# EAGLE board iob9xvrs (EAGLE 6.6.0), part 1 of 2
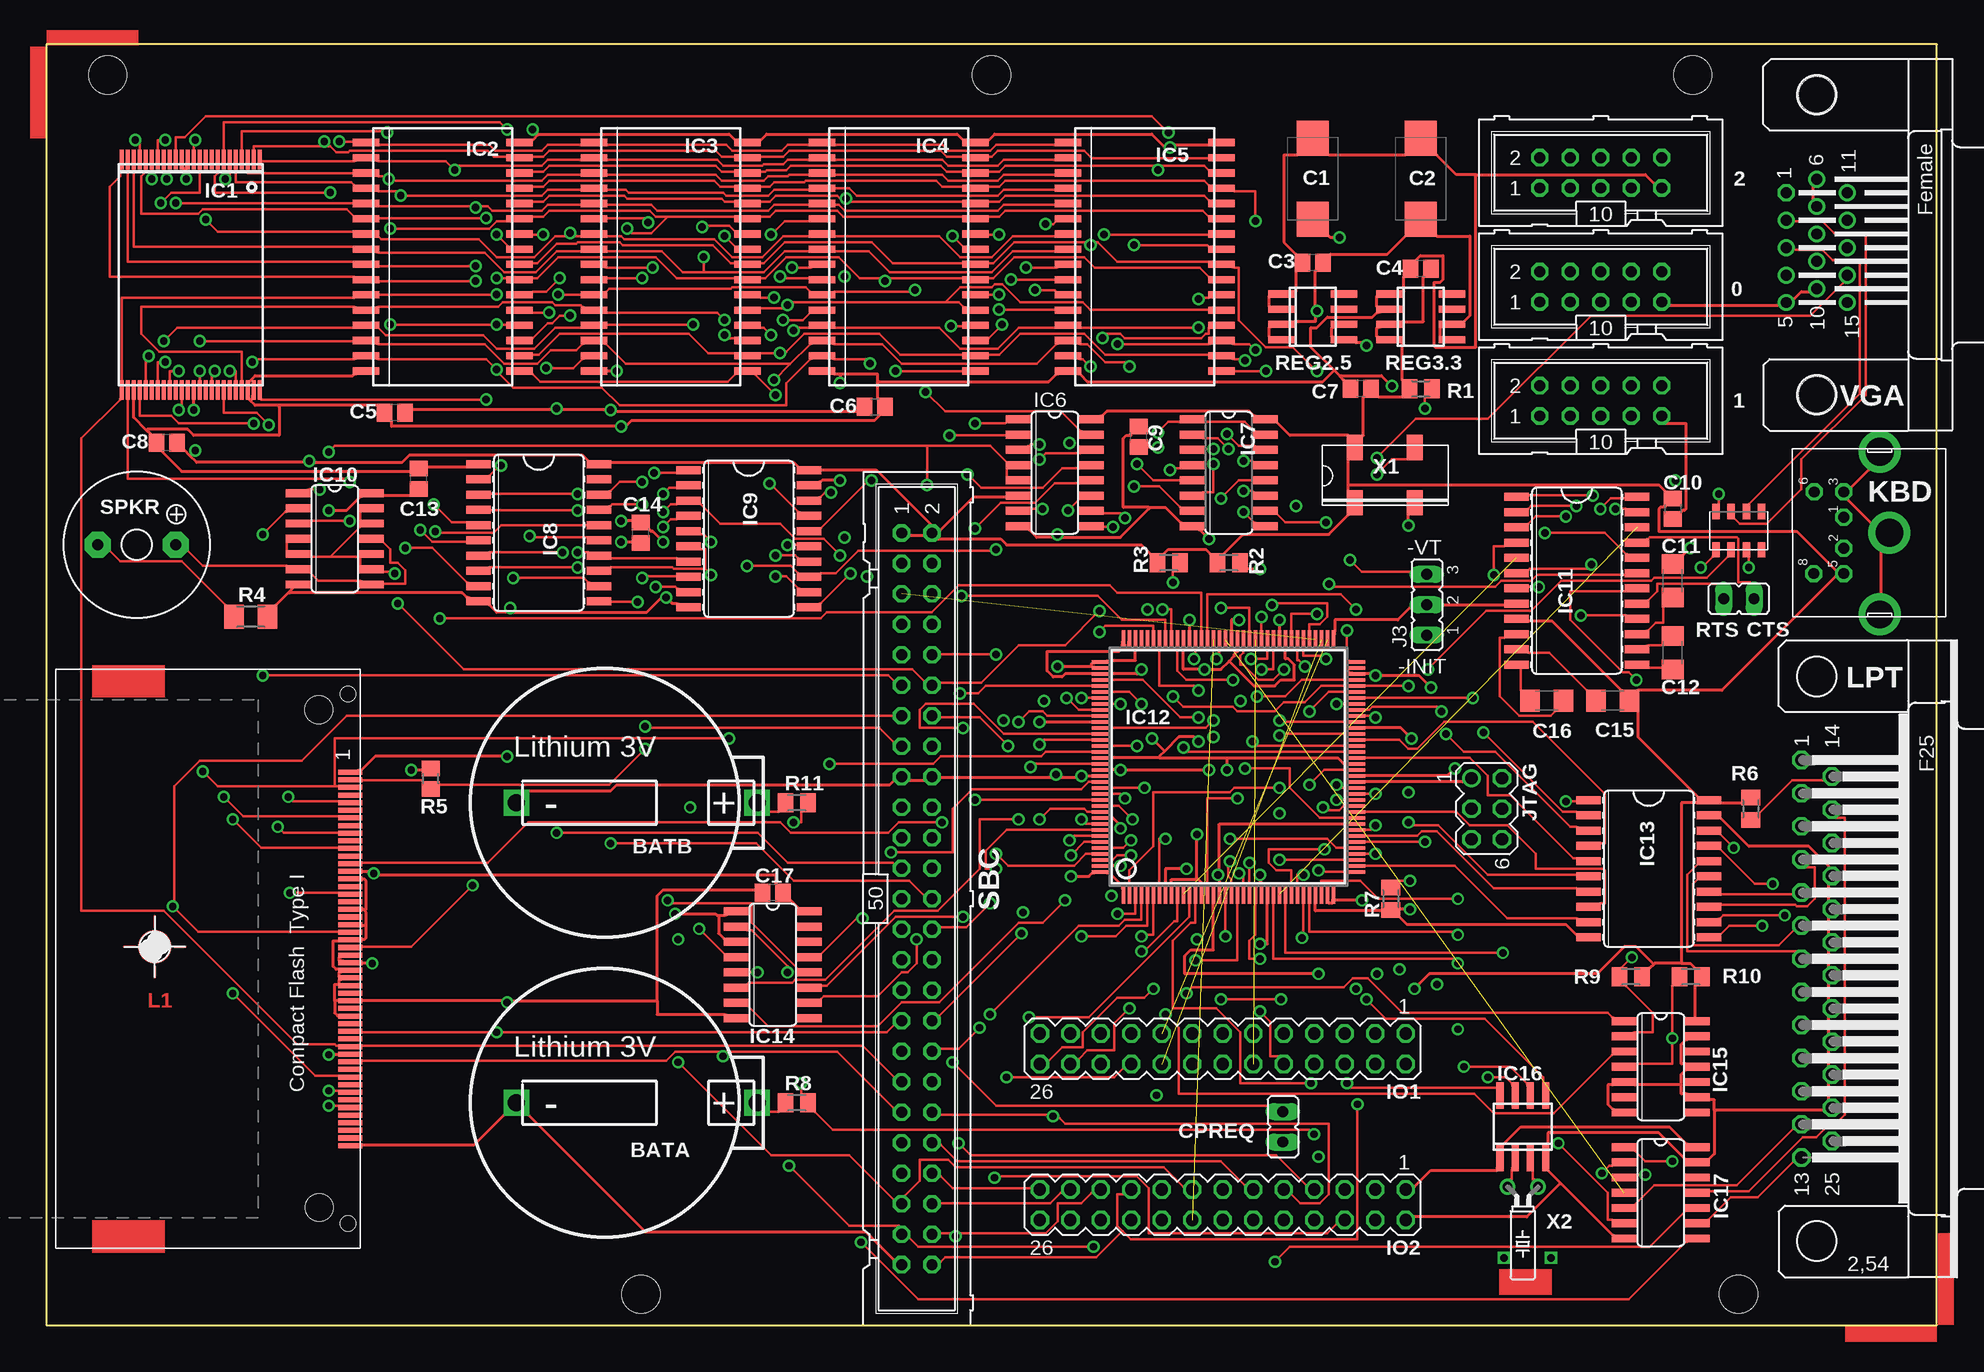
[diagram p7: board, top side]
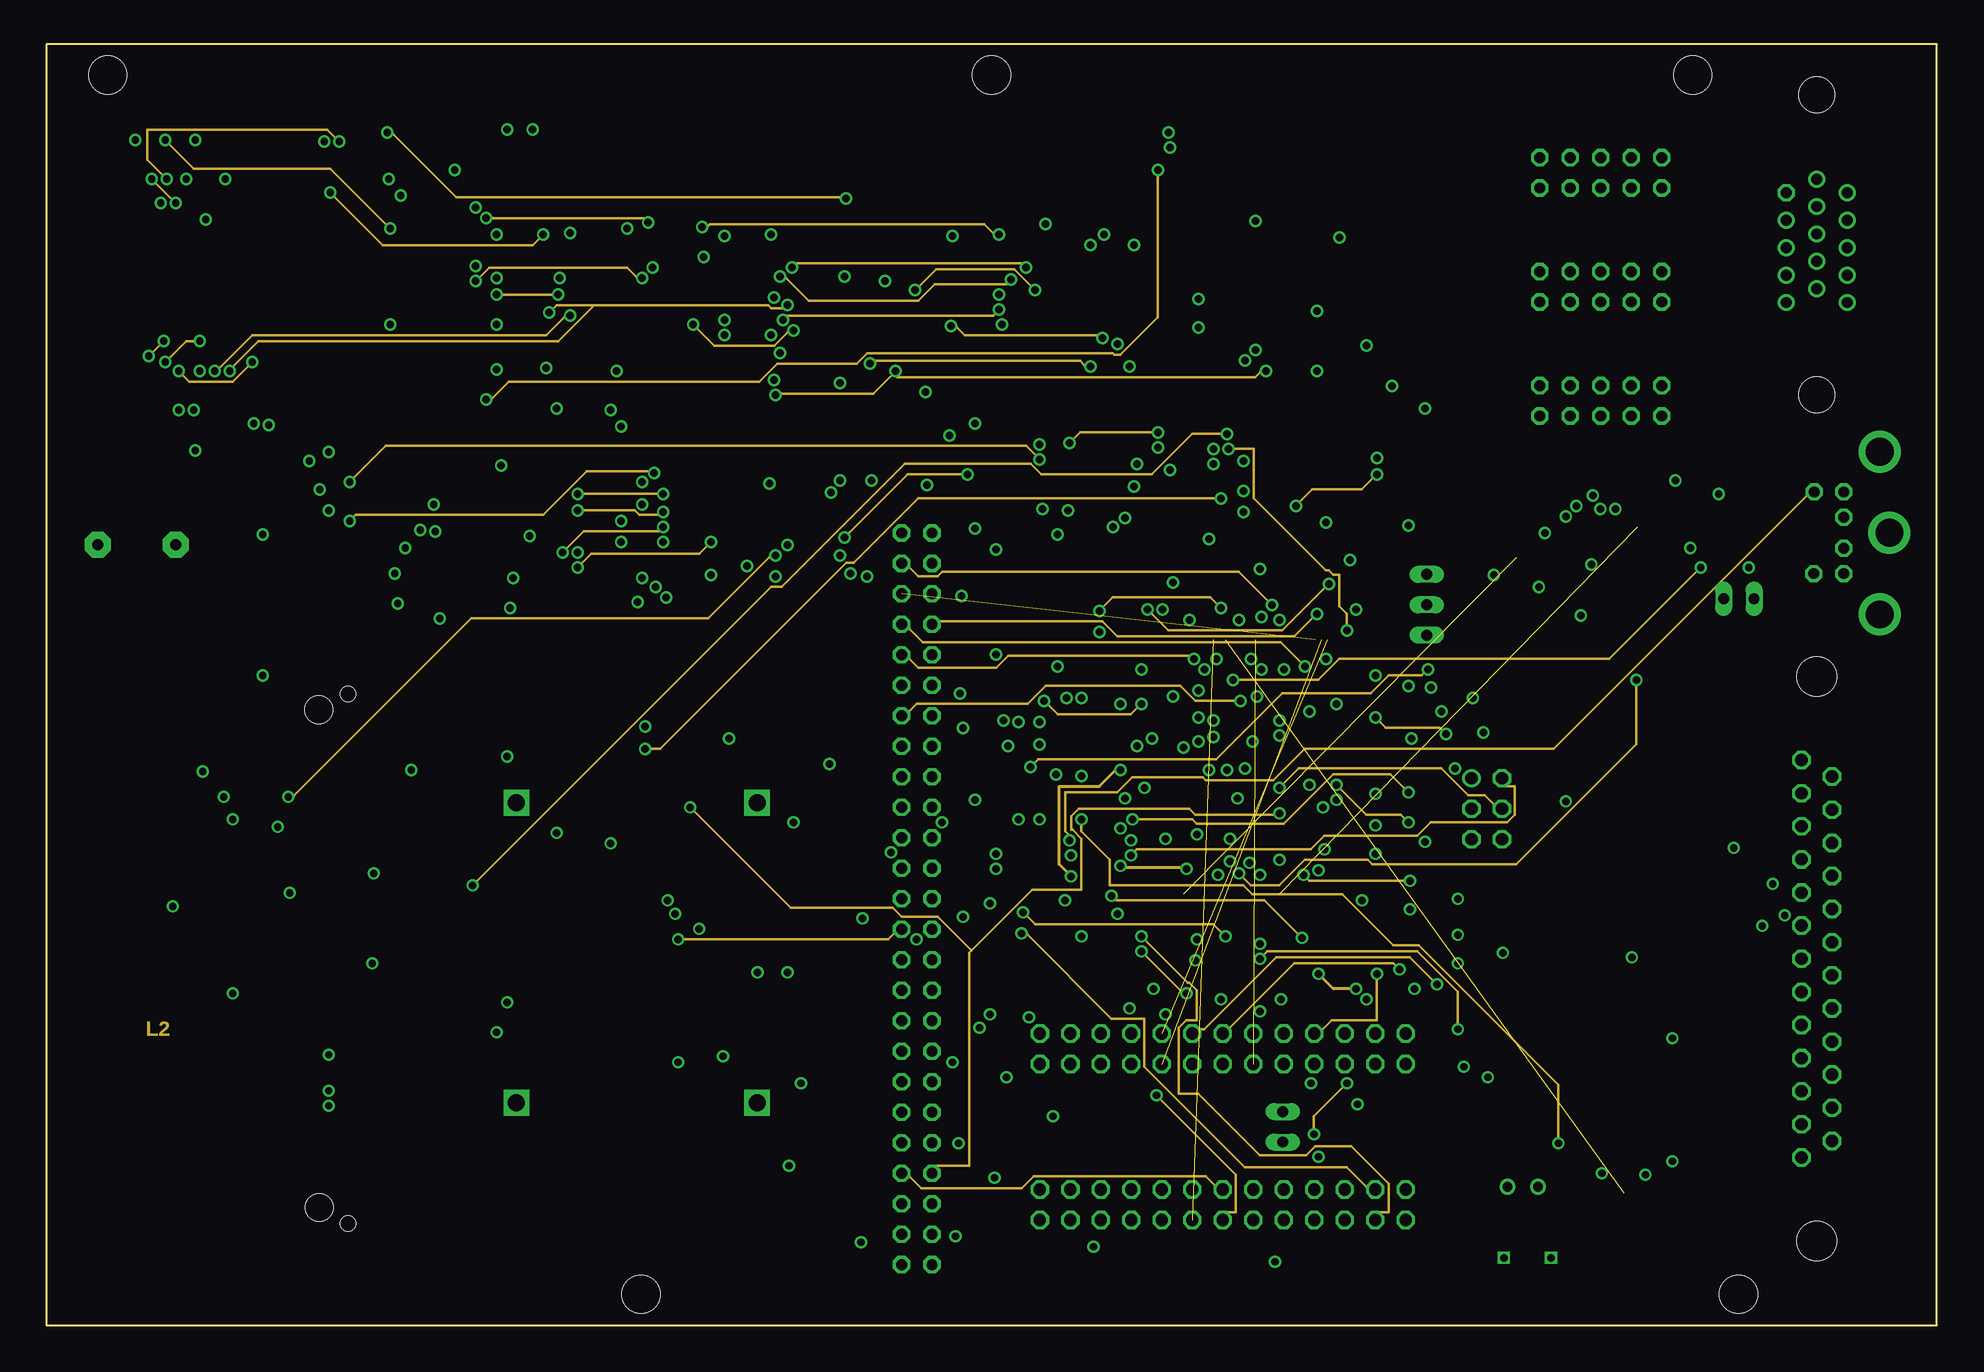
[diagram p8: board, inner layer Route2]
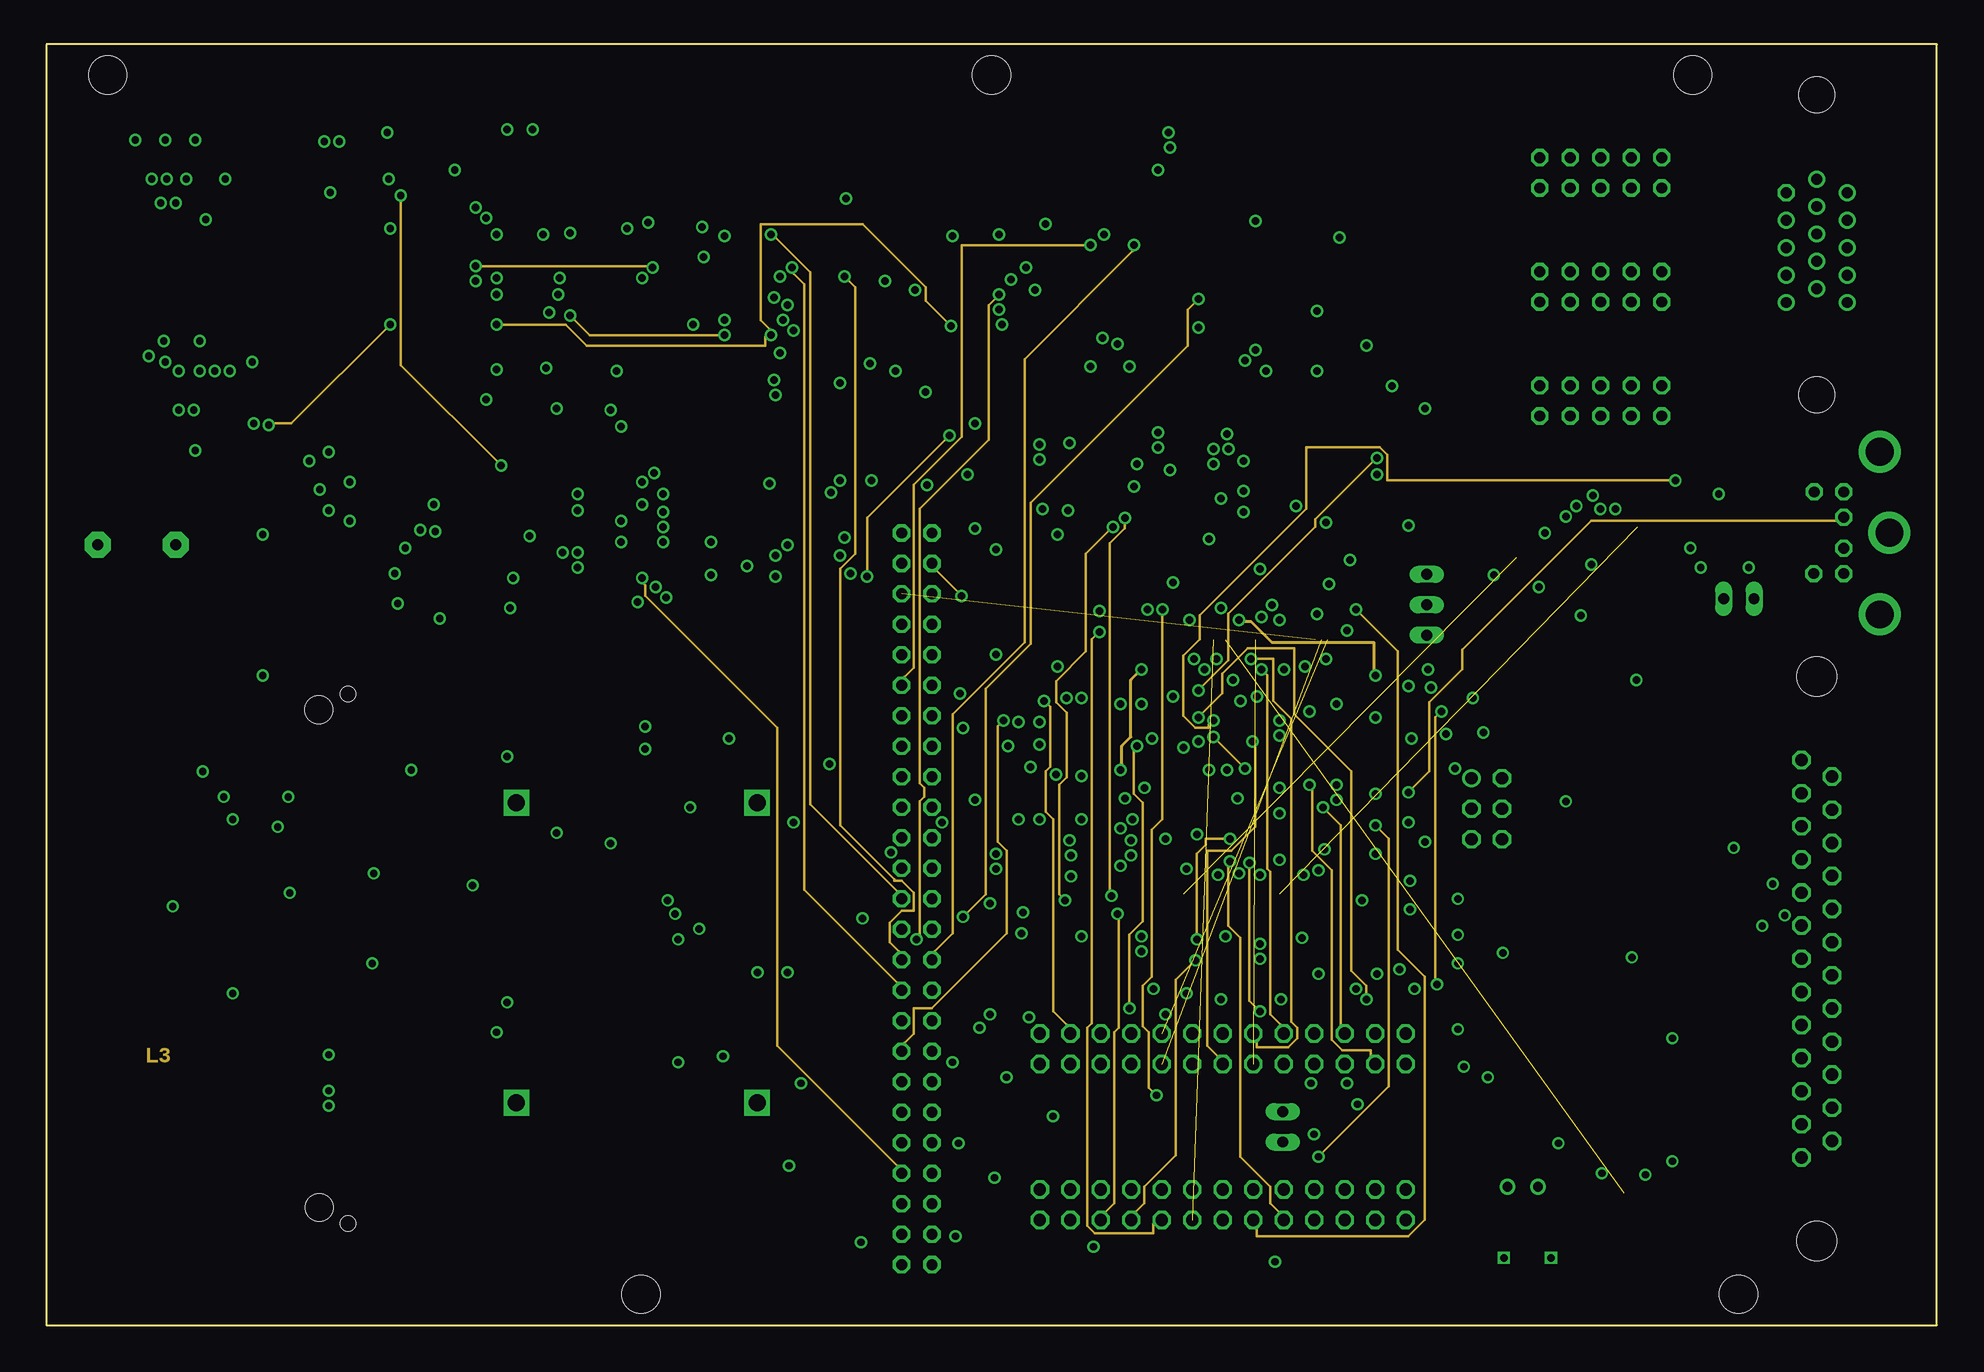
[diagram p9: board, inner layer Route15]
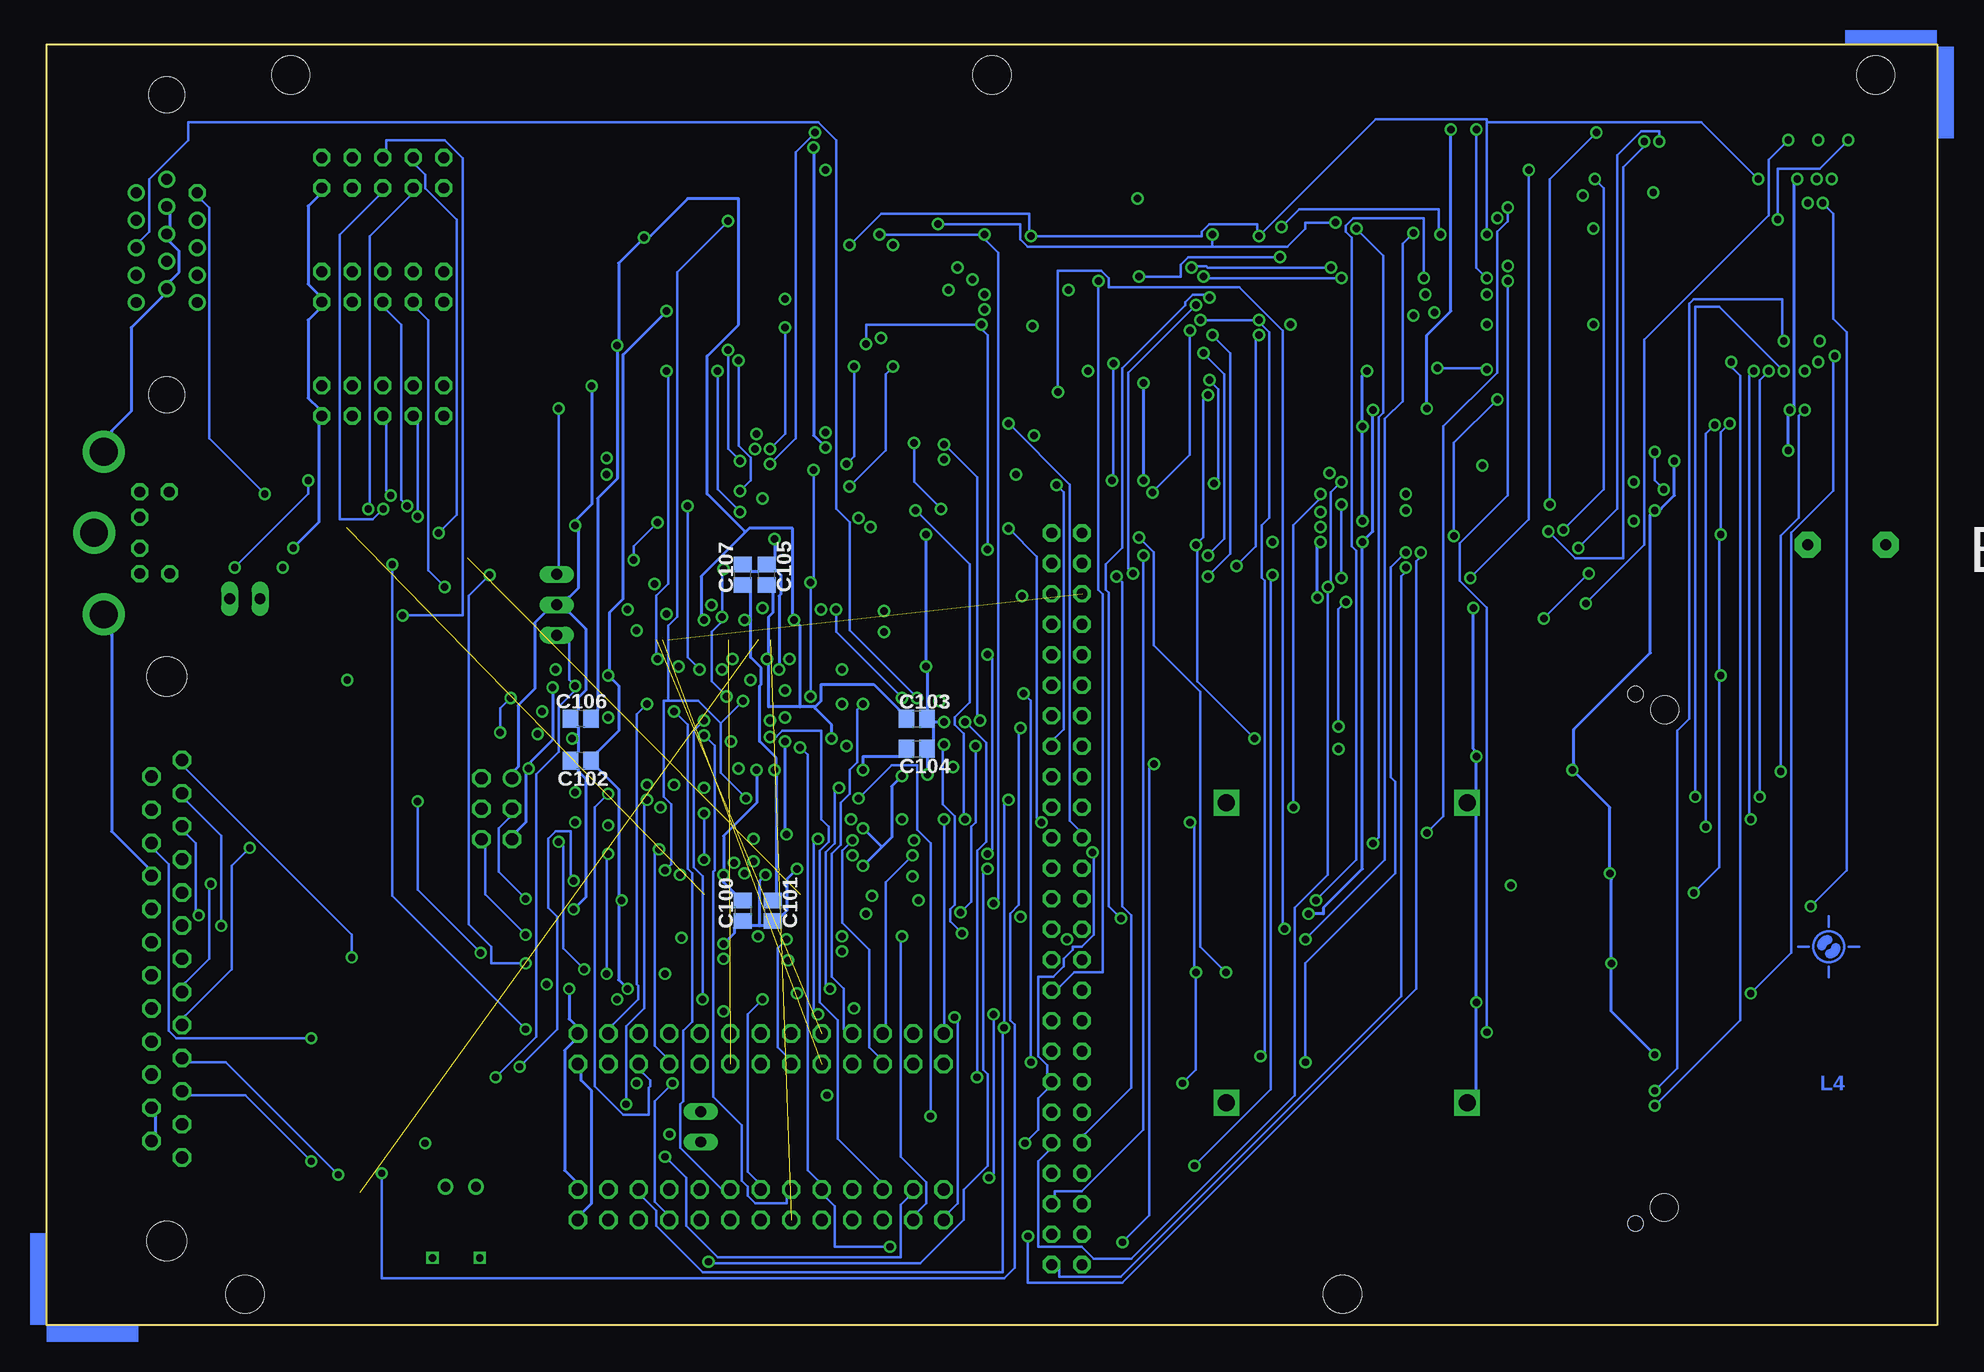
[diagram p10: board, bottom side, seen from below]

Size 157.53 x 106.73 mm. Coordinates in mm from the lower left corner, seen from the top.
Outline: 0,0 157.53,0 157.53,106.73 0,106.73 0,0
Copper layers (1*2*15*16): Top 0.035mm / dielectric 1.5mm / Route2 0.035mm / dielectric 0.15mm / Route15 0.035mm / dielectric 0.2mm / Bottom 0.035mm
Design rules "8mils": minimum track width 8mil, minimum drill 24mil, track to track 7mil, track to pad 7mil, pad to pad 7mil, via to via 7mil, smd to smd 7mil, copper to edge 25mil, drill to drill 8mil, minimum pad ring 10mil, minimum via ring 8mil, stop-mask expansion 0mil, vias tented up to drill 0mil, thermal gap 10mil
Net classes: 1 power: width 0.254 mm, drill 0.381 mm; 2 gnd: width 0.254 mm, drill 0.381 mm
Holes 3.17 mm at 78.77,104.17 141,2.57 5.11,104.17 49.56,2.57 137.19,104.17

## Footprints (pad centres in the part's own frame; a part is rotated, then mirrored left to right if it is on the bottom)
CR2032HOLDER = drill 1.422 square: + 12.7,0; - -7.366,0
D/7343-31W = smd 2.95 x 2.7: + 3.375,0; - -3.375,0
C0805 = smd 1.3 x 1.5: 1 -0.85,0; 2 0.85,0
C1206 = smd 1.6 x 1.8: 1 -1.4,0; 2 1.4,0
CF_SOCKET2_SMT = smd 0.42 x 2: 1 15.545,-17.805; 2 14.275,-17.805; 3 13.005,-17.805; 4 11.735,-17.805; 5 10.465,-17.805; 6 9.195,-17.805; 7 7.925,-17.805; 8 6.655,-17.805; 9 5.385,-17.805; 10 4.115,-17.805; 11 2.845,-17.805; 12 1.575,-17.805; 13 0.305,-17.805; 14 -0.965,-17.805; 15 -2.235,-17.805; 16 -3.505,-17.805; 17 -4.775,-17.805; 18 -6.045,-17.805; 19 -7.315,-17.805; 20 -8.585,-17.805; 21 -9.855,-17.805; 22 -11.125,-17.805; 23 -12.395,-17.805; 24 -13.665,-17.805; 25 -14.935,-17.805; 26 14.91,-17.805; 27 13.64,-17.805; 28 12.37,-17.805; 29 11.1,-17.805; 30 9.83,-17.805; 31 8.56,-17.805; 32 7.29,-17.805; 33 6.02,-17.805; 34 4.75,-17.805; 35 3.48,-17.805; 36 2.21,-17.805; 37 0.94,-17.805; 38 -0.33,-17.805; 39 -1.6,-17.805; 40 -2.87,-17.805; 41 -4.14,-17.805; 42 -5.41,-17.805; 43 -6.68,-17.805; 44 -7.95,-17.805; 45 -9.22,-17.805; 46 -10.49,-17.805; 47 -11.76,-17.805; 48 -13.03,-17.805; 49 -14.3,-17.805; 50 -15.57,-17.805 | hole 2.3: 20.747,-15.177; -20.72,-15.208 | hole 1.27: -22.062,-17.6; 22.048,-17.6
JP1 = drill 0.914 long: 1 0,-1.27; 2 0,1.27
TSOP48 = smd 0.3 x 1.6: 1 -6.25,-9.1; 2 -5.75,-9.1; 3 -5.25,-9.1; 4 -4.75,-9.1; 5 -4.25,-9.1; 6 -3.75,-9.1; 7 -3.25,-9.1; 8 -2.75,-9.1; 9 -2.25,-9.1; 10 -1.75,-9.1; 11 -1.25,-9.1; 12 -0.75,-9.1; 13 -0.25,-9.1; 14 0.25,-9.1; 15 0.75,-9.1; 16 1.25,-9.1; 17 1.75,-9.1; 18 2.25,-9.1; 19 2.75,-9.1; 20 3.25,-9.1; 21 3.75,-9.1; 22 4.25,-9.1; 23 4.75,-9.1; 24 5.25,-9.1; 25 5.25,10.1; 26 4.75,10.1; 27 4.25,10.1; 28 3.75,10.1; 29 3.25,10.1; 30 2.75,10.1; 31 2.25,10.1; 32 1.75,10.1; 33 1.25,10.1; 34 0.75,10.1; 35 0.25,10.1; 36 -0.25,10.1; 37 -0.75,10.1; 38 -1.25,10.1; 39 -1.75,10.1; 40 -2.25,10.1; 41 -2.75,10.1; 42 -3.25,10.1; 43 -3.75,10.1; 44 -4.25,10.1; 45 -4.75,10.1; 46 -5.25,10.1; 47 -5.75,10.1; 48 -6.25,10.1
SOP32 = smd 0.6 x 2.2: 1 -9.525,-6.4; 2 -8.255,-6.4; 3 -6.985,-6.4; 4 -5.715,-6.4; 5 -4.445,-6.4; 6 -3.175,-6.4; 7 -1.905,-6.4; 8 -0.635,-6.4; 9 0.635,-6.4; 10 1.905,-6.4; 11 3.175,-6.4; 12 4.445,-6.4; 13 5.715,-6.4; 14 6.985,-6.4; 15 8.255,-6.4; 16 9.525,-6.4; 17 9.525,6.4; 18 8.255,6.4; 19 6.985,6.4; 20 5.715,6.4; 21 4.445,6.4; 22 3.175,6.4; 23 1.905,6.4; 24 0.635,6.4; 25 -0.635,6.4; 26 -1.905,6.4; 27 -3.175,6.4; 28 -4.445,6.4; 29 -5.715,6.4; 30 -6.985,6.4; 31 -8.255,6.4; 32 -9.525,6.4
SO16 = smd 0.66 x 2.032: 1 -4.445,-3.073; 2 -3.175,-3.073; 3 -1.905,-3.073; 4 -0.635,-3.073; 5 0.635,-3.073; 6 1.905,-3.073; 7 3.175,-3.073; 8 4.445,-3.073; 9 4.445,3.073; 10 3.175,3.073; 11 1.905,3.073; 12 0.635,3.073; 13 -0.635,3.073; 14 -1.905,3.073; 15 -3.175,3.073; 16 -4.445,3.073
SO20W = smd 0.66 x 2.032: 1 -5.715,-5.029; 2 -4.445,-5.029; 3 -3.175,-5.029; 4 -1.905,-5.029; 5 -0.635,-5.029; 6 0.635,-5.029; 7 1.905,-5.029; 8 3.175,-5.029; 9 4.445,-5.029; 10 5.715,-5.029; 11 5.715,5.029; 12 4.445,5.029; 13 3.175,5.029; 14 1.905,5.029; 15 0.635,5.029; 16 -0.635,5.029; 17 -1.905,5.029; 18 -3.175,5.029; 19 -4.445,5.029; 20 -5.715,5.029
SO14 = smd 0.66 x 2.032: 1 -3.81,-3.073; 2 -2.54,-3.073; 3 -1.27,-3.073; 4 0,-3.073; 5 1.27,-3.073; 6 2.54,-3.073; 7 3.81,-3.073; 8 3.81,3.073; 9 2.54,3.073; 10 1.27,3.073; 11 0,3.073; 12 -1.27,3.073; 13 -2.54,3.073; 14 -3.81,3.073
SO24L = smd 0.66 x 2.032: 1 -6.985,-5.029; 2 -5.715,-5.029; 3 -4.445,-5.029; 4 -3.175,-5.029; 5 -1.905,-5.029; 6 -0.635,-5.029; 7 0.635,-5.029; 8 1.905,-5.029; 9 3.175,-5.029; 10 4.445,-5.029; 11 5.715,-5.029; 12 6.985,-5.029; 13 6.985,5.029; 14 5.715,5.029; 15 4.445,5.029; 16 3.175,5.029; 17 1.905,5.029; 18 0.635,5.029; 19 -0.635,5.029; 20 -1.905,5.029; 21 -3.175,5.029; 22 -4.445,5.029; 23 -5.715,5.029; 24 -6.985,5.029
TQFP144 = smd 0.3 x 1.6: 1 -8.75,-10.6; 2 -8.25,-10.6; 3 -7.75,-10.6; 4 -7.25,-10.6; 5 -6.75,-10.6; 6 -6.25,-10.6; 7 -5.75,-10.6; 8 -5.25,-10.6; 9 -4.75,-10.6; 10 -4.25,-10.6; 11 -3.75,-10.6; 12 -3.25,-10.6; 13 -2.75,-10.6; 14 -2.25,-10.6; 15 -1.75,-10.6; 16 -1.25,-10.6; 17 -0.75,-10.6; 18 -0.25,-10.6; 19 0.25,-10.6; 20 0.75,-10.6; 21 1.25,-10.6; 22 1.75,-10.6; 23 2.25,-10.6; 24 2.75,-10.6; 25 3.25,-10.6; 26 3.75,-10.6; 27 4.25,-10.6; 28 4.75,-10.6; 29 5.25,-10.6; 30 5.75,-10.6; 31 6.25,-10.6; 32 6.75,-10.6; 33 7.25,-10.6; 34 7.75,-10.6; 35 8.25,-10.6; 36 8.75,-10.6; 73 8.75,10.6; 74 8.25,10.6; 75 7.75,10.6; 76 7.25,10.6; 77 6.75,10.6; 78 6.25,10.6; 79 5.75,10.6; 80 5.25,10.6; 81 4.75,10.6; 82 4.25,10.6; 83 3.75,10.6; 84 3.25,10.6; 85 2.75,10.6; 86 2.25,10.6; 87 1.75,10.6; 88 1.25,10.6; 89 0.75,10.6; 90 0.25,10.6; 91 -0.25,10.6; 92 -0.75,10.6; 93 -1.25,10.6; 94 -1.75,10.6; 95 -2.25,10.6; 96 -2.75,10.6; 97 -3.25,10.6; 98 -3.75,10.6; 99 -4.25,10.6; 100 -4.75,10.6; 101 -5.25,10.6; 102 -5.75,10.6; 103 -6.25,10.6; 104 -6.75,10.6; 105 -7.25,10.6; 106 -7.75,10.6; 107 -8.25,10.6; 108 -8.75,10.6 | smd 1.6 x 0.3: 37 10.6,-8.75; 38 10.6,-8.25; 39 10.6,-7.75; 40 10.6,-7.25; 41 10.6,-6.75; 42 10.6,-6.25; 43 10.6,-5.75; 44 10.6,-5.25; 45 10.6,-4.75; 46 10.6,-4.25; 47 10.6,-3.75; 48 10.6,-3.25; 49 10.6,-2.75; 50 10.6,-2.25; 51 10.6,-1.75; 52 10.6,-1.25; 53 10.6,-0.75; 54 10.6,-0.25; 55 10.6,0.25; 56 10.6,0.75; 57 10.6,1.25; 58 10.6,1.75; 59 10.6,2.25; 60 10.6,2.75; 61 10.6,3.25; 62 10.6,3.75; 63 10.6,4.25; 64 10.6,4.75; 65 10.6,5.25; 66 10.6,5.75; 67 10.6,6.25; 68 10.6,6.75; 69 10.6,7.25; 70 10.6,7.75; 71 10.6,8.25; 72 10.6,8.75; 109 -10.6,8.75; 110 -10.6,8.25; 111 -10.6,7.75; 112 -10.6,7.25; 113 -10.6,6.75; 114 -10.6,6.25; 115 -10.6,5.75; 116 -10.6,5.25; 117 -10.6,4.75; 118 -10.6,4.25; 119 -10.6,3.75; 120 -10.6,3.25; 121 -10.6,2.75; 122 -10.6,2.25; 123 -10.6,1.75; 124 -10.6,1.25; 125 -10.6,0.75; 126 -10.6,0.25; 127 -10.6,-0.25; 128 -10.6,-0.75; 129 -10.6,-1.25; 130 -10.6,-1.75; 131 -10.6,-2.25; 132 -10.6,-2.75; 133 -10.6,-3.25; 134 -10.6,-3.75; 135 -10.6,-4.25; 136 -10.6,-4.75; 137 -10.6,-5.25; 138 -10.6,-5.75; 139 -10.6,-6.25; 140 -10.6,-6.75; 141 -10.6,-7.25; 142 -10.6,-7.75; 143 -10.6,-8.25; 144 -10.6,-8.75
SO08 = smd 0.6 x 2.2: 1 -1.905,-2.6; 2 -0.635,-2.6; 3 0.635,-2.6; 4 1.905,-2.6; 5 1.905,2.6; 6 0.635,2.6; 7 -0.635,2.6; 8 -1.905,2.6
MA13-2 = drill 1.016 octagon: 1 -15.24,-1.27; 2 -15.24,1.27; 3 -12.7,-1.27; 4 -12.7,1.27; 5 -10.16,-1.27; 6 -10.16,1.27; 7 -7.62,-1.27; 8 -7.62,1.27; 9 -5.08,-1.27; 10 -5.08,1.27; 11 -2.54,-1.27; 12 -2.54,1.27; 13 0,-1.27; 14 0,1.27; 15 2.54,-1.27; 16 2.54,1.27; 17 5.08,-1.27; 18 5.08,1.27; 19 7.62,-1.27; 20 7.62,1.27; 21 10.16,-1.27; 22 10.16,1.27; 23 12.7,-1.27; 24 12.7,1.27; 25 15.24,-1.27; 26 15.24,1.27
JP2 = drill 0.914 long: 1 -2.54,0; 2 0,0; 3 2.54,0
MA03-2 = drill 1.016: 1 -2.54,-1.27 | drill 1.016 octagon: 2 -2.54,1.27; 3 0,-1.27; 4 0,1.27; 5 2.54,-1.27; 6 2.54,1.27
M_DIN6 = drill 0.9 pad 1.422 octagon: 1 -1.3,-3.75; 2 1.3,-3.75; 3 -3.4,-3.75; 5 3.4,-3.75; 6 -3.4,-6.2; 8 3.4,-6.25 | drill 2.3 pad 3.5: SH1 6.8,-0.75; SH2 0,0.05; SH3 -6.75,-0.75
F25H = drill 1.016 octagon: 1 -16.561,-1.27; 2 -13.792,-1.27; 3 -11.049,-1.27; 4 -8.28,-1.27; 5 -5.512,-1.27; 6 -2.769,-1.27; 7 0,-1.27; 8 2.769,-1.27; 9 5.512,-1.27; 10 8.28,-1.27; 11 11.049,-1.27; 12 13.792,-1.27; 13 16.561,-1.27; 14 -15.189,1.27; 15 -12.421,1.27; 16 -9.652,1.27; 17 -6.909,1.27; 18 -4.14,1.27; 19 -1.372,1.27; 20 1.372,1.27; 21 4.14,1.27; 22 6.909,1.27; 23 9.652,1.27; 24 12.421,1.27; 25 15.189,1.27 | hole 3.302: -23.52,0; 23.52,0
M0805 = smd 1.3 x 1.6: 1 -0.95,0; 2 0.95,0
M1206 = smd 1.6 x 2: 1 -1.4,0; 2 1.4,0
R0805 = smd 1.3 x 1.5: 1 -0.85,0; 2 0.85,0
RN-CTS-744C043 = smd 0.635 x 1.27: 1 -1.905,-1.905; 2 -0.635,-1.905; 3 0.635,-1.905; 4 1.905,-1.905; 5 1.905,1.27; 6 0.635,1.27; 7 -0.635,1.27; 8 -1.905,1.27
ML50 = drill 0.914 octagon: 1 -30.48,-1.27; 2 -30.48,1.27; 3 -27.94,-1.27; 4 -27.94,1.27; 5 -25.4,-1.27; 6 -25.4,1.27; 7 -22.86,-1.27; 8 -22.86,1.27; 9 -20.32,-1.27; 10 -20.32,1.27; 11 -17.78,-1.27; 12 -17.78,1.27; 13 -15.24,-1.27; 14 -15.24,1.27; 15 -12.7,-1.27; 16 -12.7,1.27; 17 -10.16,-1.27; 18 -10.16,1.27; 19 -7.62,-1.27; 20 -7.62,1.27; 21 -5.08,-1.27; 22 -5.08,1.27; 23 -2.54,-1.27; 24 -2.54,1.27; 25 0,-1.27; 26 0,1.27; 27 2.54,-1.27; 28 2.54,1.27; 29 5.08,-1.27; 30 5.08,1.27; 31 7.62,-1.27; 32 7.62,1.27; 33 10.16,-1.27; 34 10.16,1.27; 35 12.7,-1.27; 36 12.7,1.27; 37 15.24,-1.27; 38 15.24,1.27; 39 17.78,-1.27; 40 17.78,1.27; 41 20.32,-1.27; 42 20.32,1.27; 43 22.86,-1.27; 44 22.86,1.27; 45 25.4,-1.27; 46 25.4,1.27; 47 27.94,-1.27; 48 27.94,1.27; 49 30.48,-1.27; 50 30.48,1.27
ML10 = drill 0.914 octagon: 1 -5.08,-1.27; 2 -5.08,1.27; 3 -2.54,-1.27; 4 -2.54,1.27; 5 0,-1.27; 6 0,1.27; 7 2.54,-1.27; 8 2.54,1.27; 9 5.08,-1.27; 10 5.08,1.27
KSS1201 = drill 0.914 pad 2.159 octagon: + 3.251,0; - -3.251,0
HDF15H = drill 0.9 octagon: 1 4.329,2.54 | drill 0.9: 2 2.043,2.54; 3 -0.243,2.54; 4 -2.529,2.54; 5 -4.815,2.54; 6 5.472,0; 7 3.186,0; 8 0.9,0; 9 -1.386,0; 10 -3.672,0; 11 4.329,-2.54; 12 2.043,-2.54; 13 -0.243,-2.54; 14 -2.529,-2.54; 15 -4.815,-2.54 | hole 3: -12.5,0; 12.5,0
SG636 = smd 1.3 x 2.1: P$1 0,0; P$2 5,0; P$3 5,4.6; P$4 0,4.6
TC26H = drill 0.813: 1 -1.27,0; 2 1.27,0

## Placement (x,y rotation side)
BATA  [CR2032HOLDER]  46.53,18.53 0 top
BATB  [CR2032HOLDER]  46.53,43.53 0 top
C1  10u  [D/7343-31W]  105.53,95.53 270 top
C2  10u  [D/7343-31W]  114.53,95.53 270 top
C3  0u1  [C0805]  105.53,88.53 180 top
C4  0u1  [C0805]  114.53,88.03 180 top
C5  0u1  [C0805]  29.03,76.03 180 top
C6  0u1  [C0805]  69.03,76.53 0 top
C7  0u1  [C0805]  109.53,78.03 180 top
C8  0u1  [C0805]  10.03,73.53 180 top
C9  0u1  [C0805]  91.03,74.03 90 top
C10  0u1  [C0805]  135.53,68.03 270 top
C11  [C1206]  135.53,62.03 90 top
C12  [C1206]  135.53,56.03 90 top
C13  0u1  [C0805]  31.03,70.53 90 top
C14  0u1  [C0805]  49.53,66.03 90 top
C15  [C1206]  130.53,52.03 180 top
C16  [C1206]  125.03,52.03 180 top
C17  0u1  [C0805]  60.53,36.03 180 top
C100  0u1  [C0805]  99.53,34.53 270 bottom
C101  0u1  [C0805]  97.03,34.53 270 bottom
C102  0u1  [C0805]  113.03,47.03 180 bottom
C103  0u1  [C0805]  85.03,50.53 0 bottom
C104  0u1  [C0805]  85.03,48.03 0 bottom
C105  0u1  [C0805]  97.53,62.53 90 bottom
C106  0u1  [C0805]  113.03,50.53 180 bottom
C107  0u1  [C0805]  99.53,62.53 90 bottom
CF1  CF_CMM_SOCKET2  [CF_SOCKET2_SMT]  7.53,30.53 90 top
CPREQ  [JP1]  103.03,16.53 0 top
HS2  [JP1]  141.03,60.53 270 top
IC1  LH28F400  [TSOP48]  11.53,88.03 180 top
IC2  628512  [SOP32]  33.03,89.03 270 top
IC3  628512  [SOP32]  52.03,89.03 270 top
IC4  628512  [SOP32]  71.03,89.03 270 top
IC5  628512  [SOP32]  91.53,89.03 270 top
IC6  74AHC138D  [SO16]  84.03,71.03 270 top
IC7  74HC367D  [SO16]  98.53,71.03 270 top
IC8  74ACT373D  [SO20W]  41.03,66.03 270 top
IC9  74ACT245DW  [SO20W]  58.53,65.53 270 top
IC10  74ACT32D  [SO14]  24.03,65.53 270 top
IC11  MAX208ECWG  [SO24L]  127.53,62.03 270 top
IC12  XC2S100-5TQG144C  [TQFP144]  98.5,46.51 0 top
IC13  74ACT245DW  [SO20W]  133.53,38.03 270 top
IC14  DS1321D  [SO16]  60.53,30.03 270 top
IC15  74ACT05D  [SO14]  134.53,21.53 270 top
IC16  DS1302  [SO08]  123.03,16.53 0 top
IC17  74ACT04D  [SO14]  134.53,11.03 270 top
IO1  [MA13-2]  98.03,23.03 180 top
IO2  [MA13-2]  98.03,10.03 180 top
J3  [JP2]  115.03,60.03 90 top
JTAG  [MA03-2]  120.03,43.03 270 top
KBD  [M_DIN6]  153.53,66.03 270 top
LPT  [F25H]  147.53,30.53 270 top
R1  10K  [M0805]  114.53,78.03 180 top
R2  10K  [M0805]  98.53,63.53 0 top
R3  10K  [M0805]  93.53,63.53 0 top
R4  100ohm  [M1206]  17.03,59.03 0 top
R5  10K  [R0805]  32.03,45.53 90 top
R6  4K7  [M0805]  142.03,43.03 90 top
R7  10K  [M0805]  112.03,35.53 90 top
R8  470ohm  [M0805]  62.53,18.53 0 top
R9  4K7  [M0805]  132.03,29.03 0 top
R10  4K7  [M0805]  137.03,29.03 0 top
R11  470ohm  [M0805]  62.53,43.53 0 top
REG2.5  TPS77725D  [SO08]  105.53,84.03 270 top
REG3.3  TPS77733D  [SO08]  114.53,84.03 270 top
RN2  RN2  [RN-CTS-744C043]  141.03,66.53 0 top
SBC  50E  [ML50]  72.53,35.53 270 top
SER1  [ML10]  129.53,96.03 0 top
SER2  [ML10]  129.53,86.53 0 top
SER3  [ML10]  129.53,77.03 0 top
SPKR  KSS1201  [KSS1201]  7.53,65.03 0 top
U$7  [ANGLE-ARROW-NW1-16]  0.03,106.53 0 top
U$42  [PASS-ROUND]  9.03,31.53 0 top
U$44  [ANGLE-ARROW-SE1-16]  157.53,0.03 0 top
VGA  [HDF15H]  147.53,90.03 90 top
X1  29.4912MHz  [SG636]  109.03,68.53 0 top
X2  32768  [TC26H]  123.03,11.53 180 top

## Tracks (layer width: path | path; a pad name or v marks a point on that pad's centre or on a via)
2V5  (via drill 0.61)
  Top 0.254: v110,81.63 109.75,81.88 109.12,81.88 REG2.5.5 107.12,82.38 107.12,83.13 REG2.5.6 | v107.75,90.63 107,90.63 106.87,90.75 C1.+ | v95.25,58.76 95.25,57.89 IC12.97 | v97.5,55.51 97.75,55.51 97.75,56.39 IC12.92 | v102.75,58.76 102.75,57.89 IC12.82 | v101.12,37.52 101.12,37.02 101.25,36.89 101.25,36.64 IC12.24 | 95.88,37.14 96,37.14 96.25,36.89 96.25,36.64 IC12.14 | 95.88,37.14 93.75,37.14 93.75,36.64 IC12.9 | 98.38,47.26 107.62,47.26 108.12,46.76 108.37,46.76 IC12.55 | 92.75,47.26 98.38,47.26 | 92.75,47.26 88.63,47.26 IC12.125 | v95.88,40.89 95.88,37.27 95.88,37.14 | v96,48.64 95.63,49.01 94.38,49.01 93.19,47.83 | 93.19,47.83 92.75,47.39 92.75,47.26 | v98.38,46.26 98.38,47.14 98.38,47.26 | v92.13,48.89 93.13,47.89 93.19,47.83
  Bottom 0.254: C106.1 111.62,51.26 111.62,68.88 110,70.51 v110,81.63 109.87,82.13 109.87,88.5 v107.75,90.63 107.25,90.75 104.12,93.88 99.88,93.88 99.88,83.38 102.5,80.75 102.5,69.26 99.38,66.13 99.31,66.07 | 93.5,51.51 93,52.01 93,53.39 88.63,53.39 86.5,51.26 C103.1 | 94.75,51.51 97.38,51.51 97.38,55.51 | 93.5,51.51 94.75,51.51 | 97.38,55.51 97.38,59.01 97,59.39 97,61.13 C105.1 | 94.75,51.51 94.75,51.64 94.75,58.26 v95.25,58.76 95.38,59.26 95.38,66.38 99,66.38 99.31,66.07 | 97.38,55.51 v97.5,55.51 | v102.75,58.76 103,59.01 103,62.38 99.31,66.07 | C100.1 100.25,36.02 101.12,36.89 v101.12,37.52 101.12,38.02 101.12,40.77 98.38,43.51 v98.38,46.26 | v95.88,40.89 96,41.01 v96,48.64 | v92.13,48.89 92.13,50.01 93.5,51.39 93.5,51.51
5V  (via drill 0.61)
  Top 0.254: IC17.14 136.62,15.15 135.24,16.52 122.87,16.52 121.37,15.02 IC16.1 120.87,12.9 115.37,12.9 114,11.52 IO2.1 | 133.93,30.08 133.99,30.14 136.24,30.14 | 133.93,30.08 133.62,29.77 R9.2 | 136.24,30.14 136.99,30.14 137.37,29.77 R10.2 137.37,28.27 137.37,25.64 IC15.14 | R6.2 141.24,43.51 139.49,43.51 IC13.20 | C15.1 131.24,52.89 125.49,58.64 123.49,58.64 IC11.9 | IC13.20 137.62,44.01 132.62,49.01 132.62,51.14 C15.1 | 136.24,30.14 136.24,30.27 136.24,43.51 137.62,43.51 IC13.20 | C15.1 132.62,52.89 139.61,52.89 149.11,62.38 KBD.5 149.11,62.88 145.86,66.13 134.37,66.13 134.37,68.01 134.49,68.13 134.87,68.13 134.87,68.26 C10.1 134.87,69.51 134.37,70.01 108.62,70.01 108.5,70.01 | v114,28.02 115.25,29.27 129.24,29.27 131.49,31.52 132.49,31.52 133.87,30.14 133.93,30.08 | C13.1 30.39,69.13 28.02,69.13 IC10.14 26.14,69.01 25.02,67.88 v23.52,67.88 | IC14.16 62.63,34.77 62.01,35.39 C17.1 60.76,36.77 60.76,37.52 27.77,37.52 v27.27,37.64 27.14,37.77 26.27,37.77 CF1.32 | CF1.13 24.39,30.64 24.39,30.39 CF1.38 26.27,30.14 v27.14,30.14 | v30.39,46.26 31.39,46.26 R5.2 | v23.52,22.52 24.39,22.52 CF1.44 | IC6.16 88,75.76 88.38,76.13 100.25,76.13 100.62,75.76 IC7.16 102.5,75.26 103.62,74.13 108.5,74.13 X1.P$4 | C4.1 114.75,87.38 114.75,83.63 113,83.63 REG3.3.3 110.87,83.13 110.87,82.38 REG3.3.4 113,81.88 113,78.76 R1.2 113,77.38 111,77.38 C7.1 109.75,77.38 109.75,74.13 109.62,74.13 X1.P$4 | 108.5,70.01 108.5,72.13 X1.P$4 | 108.5,70.01 108.5,69.51 X1.P$1 108.5,67.51 106.87,65.88 99.75,65.88 98.13,64.26 R2.1 97,64.26 96.63,64.63 93.5,64.63 93.13,64.26 R3.1 92,64.26 91.25,65.01 80.01,65.01 79.51,65.51 74.26,65.51 SBC.2
  Top 0.254: SBC.2 73.76,66.63 69.13,71.26 64.51,71.26 IC9.20 62.63,71.51 62.26,71.88 47.01,71.88 IC8.20 45.14,72.01 44.64,72.51 30.27,72.51 29.64,71.88 21.89,71.88 | IC6.6 80.01,69.01 77.26,69.01 74.51,66.26 SBC.2 | SBC.1 71.88,65.76 73.13,65.76 SBC.2 | 11.65,96.38 11.4,96.38 IC1.14 | 11.65,96.38 IC1.13 | 11.96,72.44 12.52,71.88 21.89,71.88 | 11.96,72.44 11.52,72.88 C8.1 | v12.27,76.26 12.27,77.13 IC1.37 | v12.4,72.88 12.02,72.51 11.96,72.44 | v11.65,95.5 11.65,96.25 11.65,96.38 | v21.89,72.01 21.89,71.88
  Bottom 0.254: IO2.1 113.5,12.02 114.37,12.9 114.37,22.89 113.62,23.64 IO1.1 113.5,25.02 114,25.52 v114,28.02 | v23.52,22.52 27.14,26.14 v27.14,30.14 27.14,37.14 v27.27,37.64 27.27,43.14 v30.39,46.26 30.27,46.76 30.27,49.64 23.89,56.01 23.89,67.51 v23.52,67.88 23.02,68.01 21.89,69.13 v21.89,72.01 | v12.4,72.88 12.4,76.13 v12.27,76.26 11.9,76.51 11.9,95.25 v11.65,95.5
B0  (via drill 0.61)
  Top 0.203: v141.86,63.13 141.86,64.01 RN2.3 | v97.25,50.39 96.63,49.76 88.63,49.76 IC12.120
  Route15 0.203: v135.74,70.38 111.75,70.38 111.75,72.51 111.12,73.13 105,73.13 105,68.01 96.13,59.14 96.13,57.14 94.75,55.76 94.75,50.76 95.75,49.76 96.88,49.76 96.88,50.01 v97.25,50.39
  Bottom 0.203: v141.86,63.13 135.74,69.26 v135.74,70.38
C0_L  (via drill 0.61)
  Top 0.203: v104.87,54.89 104.37,55.39 104.25,55.39 104.25,56.39 IC12.79
  Route2 0.203: v104.87,54.89 102.87,56.89 73.01,56.89 71.88,58.01 SBC.7
C1_L  (via drill 0.61)
  Top 0.203: v105.87,59.26 103.75,59.26 103.75,57.89 IC12.80
  Route2 0.203: v105.87,59.26 104,57.39 89.25,57.39 88,58.64 74.51,58.64 SBC.8
CF_DETECT_L  (via drill 0.61)
  Top 0.203: CF1.26 26.27,45.39 31.27,45.39 31.39,45.26 R5.1 32.77,45.01 46.89,45.01 v49.89,48.01 | v97.88,68.88 99.38,70.38 100.62,70.38 IC7.12
  Route2 0.203: v97.88,68.88 72.63,68.88 67.26,63.51 66.63,63.51 51.14,48.01 v49.89,48.01
CF_L  (via drill 0.61)
  Top 0.203: v74.63,41.89 71.01,41.89 70.13,41.01 62.01,41.01 61.13,41.89 40.14,41.89 36.77,38.52 26.27,38.52 CF1.7 | v77.38,66.38 79.51,68.51 82.38,68.51 84,70.13 86.13,70.13 IC6.12
  Bottom 0.203: v74.63,41.89 75.01,42.26 75.01,64.01 v77.38,66.38
CF_READY  (via drill 0.61)
  Top 0.203: v35.52,36.64 30.39,31.52 26.27,31.52 CF1.37 | v98.38,74.26 99.38,73.26 100.62,73.26 IC7.14
  Route2 0.203: v35.52,36.64 60.39,61.51 61.26,61.51 71.51,71.76 82,71.76 82.88,70.88 92.13,70.88 95.5,74.26 v98.38,74.26
CPUDX0  (via drill 0.61)
  Top 0.203: v82.75,48.39 83.13,48.76 87.13,48.76 IC12.122 | v81.25,32.64 74.38,25.77 SBC.34
  Route2 0.203: IO2.3 110,11.52 108.37,13.15 99.88,13.15 91.5,21.52 91.5,25.52 88.75,25.52 81.75,32.52 v81.25,32.64
  Bottom 0.203: v82.75,48.39 82.88,48.26 82.88,43.39 81.88,42.39 81.88,35.02 82.25,34.64 82.25,33.64 v81.25,32.64
CPUDX1  (via drill 0.61)
  Top 0.203: v77.38,43.76 87.13,43.76 IC12.132 | v77.76,24.77 76.01,23.02 74.51,23.02 SBC.36
  Bottom 0.203: v77.38,43.76 77.76,43.39 v77.76,24.77 77.88,24.27 77.88,4.4 102.87,4.4 106.75,8.27 106.75,9.52 107.87,10.65 IO2.5
CPUDX2  (via drill 0.61)
  Top 0.203: v70.38,39.39 75.51,39.39 75.51,43.01 77.13,44.64 86.25,44.64 86.88,45.26 87.13,45.26 IC12.129 | v76.01,15.15 77.01,14.15 102.5,14.15 105,11.65 IO2.7
  Bottom 0.203: v70.38,39.39 70.26,39.27 70.26,32.52 71.26,31.52 72.01,31.52 72.01,31.27 72.76,30.52 72.76,29.89 73.63,29.02 74.88,29.02 74.88,22.39 74.13,21.64 74.13,20.9 SBC.38 74.13,19.65 74.88,18.9 74.88,16.27 v76.01,15.15
CPUDX3  (via drill 0.61)
  Top 0.203: v89.88,43.89 89.5,44.26 88.63,44.26 IC12.131 | SBC.40 74.51,17.52 83.75,17.52 v83.88,17.4 84.38,17.27 84.88,16.77 106.87,16.77 106.87,10.9 106.12,10.15 104.5,10.15 103.75,10.9 IO2.9
  Bottom 0.203: v89.88,43.89 87.13,46.64 85,46.64 85,41.26 83.88,40.14 v83.88,17.4
CPUDX4  (via drill 0.61)
  Top 0.203: v49.64,70.26 47.76,70.26 47.01,69.51 IC8.18 | v50.76,61.51 52.39,61.51 52.51,61.38 IC9.9 | v105.25,51.14 106.87,52.76 108.37,52.76 IC12.67 | SBC.42 74.51,15.02 75.88,13.65 97.88,13.65 99.88,11.65 IO2.11
  Bottom 0.203: v49.64,70.26 50.51,69.38 50.51,61.76 v50.76,61.51 50.76,61.01 50.76,37.52 53.51,34.77 53.51,19.15 67.13,5.52 70.26,5.52 71.26,6.52 74.88,6.52 74.88,13.65 74.01,14.52 SBC.42 | v105.25,51.14 104.12,50.01 104.12,38.02 103.75,37.64 103.75,25.27 104.5,24.52 104.5,18.65 104.75,18.4 104.75,14.77 101.25,11.27 IO2.11
CPUDX5  (via drill 0.61)
  Top 0.203: v49.64,68.38 47.14,68.38 47.01,68.26 IC8.17 | v49.64,62.26 49.76,62.38 52.51,62.38 IC9.8 | v102.75,50.39 102.87,50.26 108.37,50.26 IC12.62 | v97.88,27.14 v102.87,27.14
  Route2 0.203: SBC.43 71.88,12.4 72.88,11.4 81.25,11.4 82.25,12.4 96.63,12.4 97.38,11.65 IO2.13
  Route15 0.203: v49.64,62.26 49.76,61.76 49.89,61.63 49.89,60.76 60.88,49.76 60.88,23.27 70.88,13.27 SBC.43
  Bottom 0.203: v49.64,62.26 v49.64,68.38 | v102.75,50.39 103.62,49.51 103.62,38.14 102.87,37.39 v102.87,27.14 | v97.88,27.14 99.13,25.89 99.13,12.77 98.38,12.02 IO2.13
CPUDX6  (via drill 0.61)
  Top 0.203: IC9.7 52.51,63.88 47.01,63.88 IC8.14 45.14,64.38 v44.26,64.38 | v102.75,49.14 102.87,49.26 108.37,49.26 IC12.60 | IO2.15 94.75,11.52 93.13,13.15 75.76,13.15 75.13,13.77 72.76,13.77 72.76,12.02 71.51,10.77 SBC.45 70.63,10.4 66.88,14.15 60.39,14.15 v52.64,21.89
  Bottom 0.203: v102.75,49.14 101.87,48.26 101.87,37.89 102,37.77 102,19.02 99.63,16.65 99.63,12.02 99.13,11.52 99.13,10.77 98.5,10.15 95.88,10.15 95.88,10.65 IO2.15 | v44.26,64.38 45.51,63.13 45.51,45.64 45.14,45.26 45.14,37.64 52.64,30.14 v52.64,21.89
CPUDX7  (via drill 0.61)
  Top 0.203: 54.82,63.07 54.89,63.13 54.89,64.63 54.51,64.63 IC9.6 | 54.82,63.07 54.76,63.01 52.26,63.01 52.14,63.13 47.01,63.13 IC8.13 | v94.75,48.14 95.13,47.76 108.37,47.76 IC12.57 | v87.25,6.52 72.63,6.52 71.88,7.27 SBC.47 71.01,8.27 66.88,8.27 v61.88,13.27 | v55.39,62.51 54.89,63.01 54.82,63.07
  Bottom 0.203: v94.75,48.14 94.13,47.51 94.13,12.9 93.25,12.02 IO2.17 92.63,10.65 91.88,9.9 91.88,6.52 v87.25,6.52 | v55.39,62.51 55.51,62.38 55.51,19.65 v61.88,13.27
CPUDX8  (via drill 0.61)
  Top 0.203: v44.26,63.13 36.89,63.13 IC8.8 | v55.39,65.26 54.76,65.88 54.51,65.88 IC9.5 | v107.5,43.76 108.37,43.76 IC12.49 | v109.25,18.4 109.25,7.15 90.38,7.15 89.69,7.84 | 89.69,7.84 89.25,8.27 89.25,10.9 89.75,10.9 IO2.19 | SBC.50 74.51,5.27 74.88,5.65 87.5,5.65 89.63,7.77 89.69,7.84
  Route2 0.203: v44.26,63.13 45.39,64.26 54.39,64.26 v55.39,65.26
  Bottom 0.203: v107.5,43.76 107.75,43.51 107.75,26.39 109.25,24.89 v109.25,18.4 | v44.26,63.13 44.39,62.63 44.64,62.38 44.64,27.39 68.01,4.02 73.13,4.02 73.13,4.77 SBC.50
CPUDX9  (via drill 0.61)
  Top 0.203: v43.01,64.38 36.89,64.38 IC8.7 | v51.39,66.51 52.01,67.13 52.51,67.13 IC9.4 | v99.88,46.39 103.62,46.39 103.62,44.76 106.12,42.26 108.37,42.26 IC12.46 | 75.76,7.65 83.25,7.65 84.25,8.65 84.25,10.15 86.25,10.15 87.13,11.02 IO2.21 | 75.76,7.65 74.51,7.65 SBC.48 | v75.76,7.4 75.76,7.65
  Route2 0.203: v43.01,64.38 44.76,66.13 51.01,66.13 v51.39,66.51
  Route15 0.203: v97.25,49.01 v99.88,46.39
  Bottom 0.203: v97.25,49.01 96.75,49.01 96.25,49.51 93,49.51 93,42.14 92.38,41.51 92.38,40.27 93.13,39.52 93.13,26.89 91.63,25.39 91.63,15.52 88.13,12.02 IO2.21 | v75.76,7.4 75.76,3.52 67.88,3.52 43.39,28.02 43.39,63.63 43.14,63.88 v43.01,64.38
CPUDX10  (via drill 0.61)
  Top 0.203: v44.26,67.88 36.89,67.88 IC8.4 | v51.39,67.76 52.01,68.38 52.51,68.38 IC9.3 54.51,68.38 56.14,66.76 61.13,66.76 62.38,65.51 64.76,65.51 v66.13,64.13 | v110.75,41.64 110.37,41.26 109.87,41.26 IC12.44 | SBC.46 74.51,10.15 83.63,10.15 84.5,11.02 84.63,11.02 IO2.23
  Route2 0.203: v44.26,67.88 49.01,67.88 49.39,67.51 51.14,67.51 v51.39,67.76
  Route15 0.203: v110.75,41.64 111.87,40.52 111.87,19.9 v106,14.02
  Bottom 0.203: v106,14.02 104.25,12.27 104.25,8.27 101.62,5.65 86.38,5.65 86.38,10.02 85.75,10.65 IO2.23 | v66.13,64.13 66.13,16.27 71.26,11.15 73.51,11.15 73.51,10.77 SBC.46
CPUDX11  (via drill 0.61)
  Top 0.203: v44.26,69.26 36.89,69.26 IC8.3 | v51.39,69.26 51.89,69.76 52.51,69.76 IC9.2 | v102.75,38.77 108.37,38.77 IC12.39 | IO2.25 82.13,11.4 75.51,11.4 74.51,12.4 SBC.44
  Route2 0.203: v51.39,69.26 v44.26,69.26 | v102.75,42.64 102.62,42.51 95.75,42.51 95.25,43.01 86,43.01 85.38,42.39 85.38,41.26 85.5,41.26 86.25,40.52 86.25,36.27 82.13,36.27 77.07,31.21 | 77.07,31.21 76.88,31.02 76.88,13.27 74.13,13.27 SBC.44 | v53.64,43.14 62.01,34.77 70.51,34.77 71.26,34.02 74.26,34.02 77.01,31.27 77.07,31.21
  Bottom 0.203: v102.75,42.64 v102.75,38.77 | v53.64,43.14 53.64,66.63 51.51,68.76 v51.39,69.26
CTS2
  Top 0.203: IC11.17 133.49,60.39 134.24,61.13 134.24,61.76 139.36,61.76 HS2.1
DA0  (via drill 0.61)
  Top 0.203: IC1.5 15.77,96.38 15.77,95.25 25.39,95.25 25.64,95 IC2.4 27.64,94.5 29.14,94.5 v29.52,94.13 30.02,94.13 41.26,94.13 41.76,94.63 44.64,94.63 IC3.4 46.64,94.63 48.26,94.63 48.51,94.38 56.39,94.38 56.64,94.13 60.14,94.13 60.63,94.63 63.63,94.63 IC4.4 65.63,94.75 66.88,94.75 67.51,94.13 79.26,94.13 79.76,94.63 84.13,94.63 IC5.4 | v37.89,71.63 37.77,71.63 36.89,70.76 IC8.2
  Route15 0.203: v37.89,71.63 29.52,80.01 v29.52,94.13
DA1  (via drill 0.61)
  Top 0.203: v28.39,99.38 28.27,99.5 16.27,99.5 16.27,97.88 IC1.4 | v32.27,68.38 33.77,66.88 35.02,66.88 IC8.5 | IC2.28 40.52,93.63 41.39,93.63 41.89,94.13 48.14,94.13 48.39,93.88 56.26,93.88 56.51,93.63 57.39,93.63 IC3.28 59.51,93.63 60.26,93.63 60.76,94.13 65.88,94.13 66.38,93.63 66.63,93.63 | 66.63,93.63 76.38,93.63 IC4.28 78.51,93.63 79.38,93.63 79.88,94.13 96.5,94.13 96.88,93.75 IC5.28 | v66.63,93.88 66.63,93.63
  Route2 0.203: v66.63,93.88 66.51,94 34.14,94 28.89,99.25 v28.39,99.38
  Bottom 0.203: v28.39,99.38 32.27,95.5 v32.27,68.38
DA2  (via drill 0.61)
  Top 0.203: IC5.3 84.13,95.88 79.76,95.88 79.26,95.38 75.13,95.38 74.63,95.88 65.63,95.88 IC4.3 63.63,95.88 61.88,95.88 61.76,95.75 60.14,95.75 59.76,95.38 56.26,95.38 55.76,95.88 46.64,95.88 IC3.3 44.64,95.88 41.76,95.88 41.26,95.38 29.02,95.38 v28.52,95.5 28.27,95.75 27.64,95.75 IC2.3 25.64,96 16.77,96 16.77,96.38 IC1.3 | v31.14,66.26 32.14,65.26 35.02,65.26 IC8.6
  Bottom 0.203: v31.14,66.26 27.77,69.63 27.77,94.75 v28.52,95.5
DA3  (via drill 0.61)
  Top 0.203: 23.14,98.25 23.64,98.25 24.14,97.75 25.14,97.75 25.27,97.88 36.77,97.88 37.27,97.38 38.39,97.38 IC2.31 40.52,97.38 41.39,97.38 41.89,97.88 55.76,97.88 56.26,97.38 57.39,97.38 IC3.31 59.51,97.38 61.38,97.38 61.88,97.88 74.51,97.88 75.01,97.38 76.38,97.38 IC4.31 78.51,97.38 78.76,97.38 79.26,97.88 86.5,97.88 87.13,97.25 96.88,97.25 IC5.31 | 23.14,98.25 17.27,98.25 17.27,97.88 IC1.2 | v29.89,64.76 32.14,64.76 35.02,61.88 IC8.9 | v23.14,98.63 23.14,98.25
  Bottom 0.203: v29.89,64.76 26.64,68.01 26.64,97.5 24.64,99.5 23.14,99.5 v23.14,98.63
DA4  (via drill 0.61)
  Top 0.203: IC5.2 84.13,97.13 79.76,97.13 79.26,96.63 75.13,96.63 74.63,97.13 65.63,97.13 IC4.2 63.63,97.13 61.76,97.13 61.38,96.75 59.76,96.75 59.64,96.63 56.39,96.63 55.89,97.13 46.64,97.13 IC3.2 44.64,97.13 41.76,97.13 41.26,96.63 34.27,96.63 v34.02,96.25 33.27,97 27.64,97 IC2.2 25.64,97 17.9,97 IC1.1 | v38.89,62.26 44.76,62.26 45.14,61.88 IC8.12
  Bottom 0.203: v38.89,62.26 34.02,67.13 v34.02,96.25
DA5  (via drill 0.61)
  Top 0.203: v36.64,77.13 17.9,77.13 IC1.48 | v40.27,65.76 40.39,65.63 45.14,65.63 IC8.15 | IC2.30 40.52,96.13 41.39,96.13 41.89,96.63 55.76,96.63 56.26,96.13 57.39,96.13 IC3.30 59.51,96.13 59.89,96.13 60.01,96.25 61.63,96.25 62.01,96.63 74.51,96.63 75.01,96.13 76.38,96.13 IC4.30 78.51,96.13 79.38,96.13 79.88,96.63 92.63,96.63 | 92.63,96.63 96.5,96.63 96.88,96.25 IC5.30 | v92.63,96.25 92.63,96.63
  Route2 0.203: v92.63,96.25 92.63,84 89.5,80.88 89,80.88 88.88,81 68.38,81 67.51,80.13 60.88,80.13 59.39,78.63 38.52,78.63 37.14,77.26 v36.64,77.13
  Bottom 0.203: v36.64,77.13 40.27,73.51 v40.27,65.76
DA6  (via drill 0.61)
  Top 0.203: IC5.1 84.13,98.38 79.13,98.38 78.63,97.88 75.13,97.88 74.63,98.38 65.63,98.38 IC4.1 63.63,98.38 61.76,98.38 61.26,97.88 57.14,97.88 56.64,98.38 46.64,98.38 IC3.1 44.64,98.38 41.76,98.38 41.26,97.88 37.39,97.88 36.89,98.38 27.64,98.38 IC2.1 25.64,98.63 v24.39,98.63 | v10.02,95.5 9.77,95.5 9.77,96.38 IC1.17 | v32.39,66.13 32.52,66.01 37.27,66.01 37.89,66.63 45.14,66.63 IC8.16
  Route2 0.203: v10.02,95.5 8.4,97.13 8.4,99.63 23.39,99.63 v24.39,98.63
  Bottom 0.203: v32.39,66.13 30.14,63.88 26.14,63.88 26.14,96.5 24.52,98.13 v24.39,98.63
DISK_CE_L  (via drill 0.61)
  Top 0.203: v22.77,69.63 21.89,69.63 IC10.1 | v23.52,72.76 24.02,73.26 73.38,73.26 | 73.38,73.26 78.63,73.26 80.01,71.88 IC6.4 80.01,71.38 80.01,70.63 IC6.5 | 73.38,73.26 v73.38,70.01
  Bottom 0.203: v22.77,69.63 23.52,70.38 v23.52,72.76 | v73.38,70.01 72.76,69.38 72.76,49.64 73.51,48.89 SBC.16
DX4  (via drill 0.61)
  Top 0.203: v15.27,79.51 15.77,79.51 15.77,78.63 IC1.44 | v15.52,42.14 17.9,39.77 24.39,39.77 CF1.6 | v67.01,62.63 64.51,60.14 IC9.11 | IC3.21 59.51,84.75 61.51,84.75 v61.76,85 62.13,85.25 74.88,85.25 | v41.89,84.38 40.52,84.38 IC2.21 | 74.88,85.25 76.01,85.25 76.38,84.88 IC4.21 | 74.88,85.25 76.13,86.5 78.76,86.5 79.01,86.75 79.63,86.75 81.13,85.25 86.38,85.25 87,84.63 96.88,84.63 IC5.21
  Route2 0.203: v41.89,84.38 42.51,85 45.64,85 | 45.64,85 60.14,85 60.39,84.75 61.38,84.75 v61.76,85 | 45.64,85 42.64,82 17.65,82 15.52,79.88 v15.27,79.51
  Bottom 0.203: v15.27,79.51 15.65,79.13 15.65,42.26 v15.52,42.14 | v67.01,62.63 67.38,63.01 67.38,79.38 v61.76,85
DX5  (via drill 0.61)
  Top 0.203: v18.52,75.01 17.52,76.01 14.77,76.01 14.77,77.13 IC1.42 | v19.27,41.51 19.77,41.01 24.39,41.01 CF1.5 | v28.64,83.38 v37.52,83.38 38.39,83.38 IC2.20 | v60.76,62.38 61.63,62.38 62.63,61.38 IC9.12 | v60.39,82.5 59.76,83.13 59.51,83.13 IC3.20 | v75.38,83.25 76.38,83.25 IC4.20 | v88,82.25 88.38,82.63 89.5,82.63 89.88,82.25 96.25,82.25 96.63,82.63 96.88,82.63 96.88,83.13 IC5.20
  Route2 0.203: v88,82.25 87.75,82.5 76.51,82.5 75.88,83.13 v75.38,83.25
  Route15 0.203: v28.64,83.38 20.4,75.13 19.02,75.13 v18.52,75.01 | v75.38,83.25 73.26,85.38 73.26,86.5 68.01,91.75 59.51,91.75 59.51,83.75 60.26,83 v60.39,82.5 59.89,82.38 59.89,81.63 45.01,81.63 43.26,83.38 v37.52,83.38
  Bottom 0.203: v18.52,75.01 19.27,74.26 v19.27,41.51 | v60.76,62.38 58.89,64.26 58.89,81 v60.39,82.5
DX6  (via drill 0.61)
  Top 0.203: v14.02,79.51 13.77,79.51 13.77,78.63 IC1.40 | v14.77,44.01 16.4,42.39 24.39,42.39 CF1.4 | v99.75,72.01 100.5,72.01 100.62,71.88 IC7.13 | v100.75,81.25 100.25,81.75 99,81.75 IC5.19 96.88,81.75 v89.25,81.75 | v79.63,83.38 78.51,82.25 IC4.19 | v58.39,63.26 62.01,63.26 62.63,62.63 IC9.13 64.51,62.63 65.76,62.63 67.63,64.51 79.01,64.51 v79.13,64.63 | v56.51,82.5 56.76,82.25 57.39,82.25 IC3.19 | v43.64,84.13 42.76,84.13 42.14,83.5 41.76,83.5 40.52,82.25 IC2.19
  Route2 0.203: v14.02,79.51 14.4,79.76 17.15,82.5 41.64,82.5 43.14,84 v43.64,84.13
  Route15 0.203: v43.64,84.13 45.26,82.5 56.01,82.5 v56.51,82.5
  Bottom 0.203: v14.02,79.51 14.77,78.76 v14.77,44.01 | v99.75,72.01 100.75,73.01 v100.75,81.25 | v89.25,81.75 89.25,83.38 v79.63,83.38 79.51,82.88 79.13,82.5 v79.13,64.63 | v58.39,63.26 56.76,64.88 56.76,82.25 v56.51,82.5
DX7  (via drill 0.61)
  Top 0.203: v12.77,79.51 12.77,78.63 IC1.38 | v20.15,44.01 20.52,43.64 24.39,43.64 CF1.3 | v99.75,69.51 100.5,69.51 100.62,69.38 IC7.11 | v99.88,80.38 99.75,80.5 99,80.5 IC5.18 96.88,80.88 88.25,80.88 86.5,82.63 81.13,82.63 79.38,80.88 78.51,80.88 IC4.18 76.38,80.88 71.13,80.88 69.38,82.63 63.13,82.63 61.63,81.13 v61.13,81 59.51,81 IC3.18 57.39,81 55.14,81 53.51,82.63 42.76,82.63 41.01,80.88 40.52,80.88 IC2.18 | v60.76,64.13 62.38,64.13 62.63,63.88 IC9.14
  Route2 0.203: v20.15,44.01 20.65,44.14 35.39,58.89 55.14,58.89 60.26,64.01 v60.76,64.13
  Bottom 0.203: v12.77,79.51 18.15,84.88 20.15,84.88 v20.15,44.01 | v99.75,69.51 98.88,70.38 98.88,72.26 99.88,73.26 v99.88,80.38 | v60.76,64.13 59.39,65.51 59.39,79.26 v61.13,81
DX8  (via drill 0.61)
  Top 0.203: v11.02,76.26 11.27,76.26 11.27,77.13 IC1.35 | v13.02,46.14 14.27,44.89 24.02,44.89 | 24.02,44.89 24.39,44.89 CF1.2 | v99.75,67.76 100.62,66.88 IC7.9 | v101.62,79.51 99,79.51 IC5.17 | v61.76,65.01 62.63,65.01 IC9.15 | v60.76,77.51 59.01,79.26 IC3.17 57.39,79.26 56.76,78.63 41.14,78.63 40.52,79.26 IC2.17 | v70.76,79.51 76.38,79.51 IC4.17 | 24.02,44.89 24.02,48.89 v56.89,48.89
  Route2 0.203: v60.76,77.51 61.26,77.63 68.88,77.63 v70.76,79.51 70.88,79.01 100.75,79.01 101.12,79.38 v101.62,79.51
  Bottom 0.203: v11.02,76.26 11.52,75.76 11.52,67.26 13.02,65.76 v13.02,46.14 | v99.75,67.76 101.62,69.63 v101.62,79.51 | v60.76,77.51 61.13,77.13 61.13,65.63 v61.76,65.01 61.63,64.51 61.63,53.64 v56.89,48.89
DX9  (via drill 0.61)
  Top 0.203: v90.63,69.88 92.75,69.88 94.5,68.13 IC7.7 | v87,79.88 86.38,80.5 86.13,80.5 IC5.15 | v68.76,70.38 68.51,70.38 64.51,66.38 IC9.16 | v68.63,80.13 68.26,80.5 65.63,80.5 IC4.15 63.63,80.5 61.63,78.51 61.63,76.63 47.76,76.63 46.26,78.13 38.89,78.13 37.77,79.26 v37.52,79.63 36.64,80.5 27.64,80.5 IC2.15 25.64,80.5 17.4,80.5 v17.15,80.26 | v11.02,79.51 10.27,79.51 10.27,78.63 IC1.33 | v23.52,18.27 24.39,18.27 CF1.23 | v41.64,79.76 43.89,79.76 44.64,80.5 IC3.15
  Route2 0.203: v11.02,79.51 11.9,78.63 15.52,78.63 v17.15,80.26 | v87,79.88 86.5,80.01 86.13,80.38 69.01,80.38 v68.63,80.13
  Bottom 0.203: v90.63,69.88 87.63,72.88 87.63,79.26 v87,79.88 | v68.76,70.38 68.63,70.51 v68.63,80.13 | v23.52,18.27 16.4,25.39 16.4,79.13 17.02,79.76 v17.15,80.26 | v41.64,79.76 37.52,79.76 v37.52,79.63
DX10  (via drill 0.61)
  Top 0.203: v90.88,71.76 92.25,70.38 94.5,70.38 IC7.5 | v90.25,79.88 89.88,80.26 88.25,80.26 86.75,81.75 86.13,81.75 IC5.14 84.13,81.75 82.5,80.13 71.26,80.13 69.63,81.75 65.63,81.75 IC4.14 63.63,81.75 61.95,80.07 | v60.26,70.13 62.63,67.76 IC9.17 | 61.95,80.07 v60.63,78.76 | 61.95,80.07 61.88,80.13 48.26,80.13 46.64,81.75 IC3.14 44.64,81.75 44.14,81.25 42.01,81.25 40.89,80.13 38.14,80.13 36.52,81.75 27.64,81.75 IC2.14 25.64,82 v12.77,82 | v9.9,80.26 9.27,80.26 9.27,78.63 IC1.31 | v23.52,19.52 24.39,19.52 CF1.22
  Route2 0.203: v9.9,80.26 11.65,82 v12.77,82
  Bottom 0.203: v90.88,71.76 90.25,72.38 v90.25,79.88 | v60.26,70.13 59.89,70.51 59.89,78.01 v60.63,78.76 | v23.52,19.52 21.64,21.4 21.64,49.51 20.65,50.51 20.65,85.13 20.27,85.5 12.9,85.5 12.9,82.5 v12.77,82
DX11  (via drill 0.61)
  Top 0.203: v65.38,69.38 64.88,69.38 64.51,69.01 IC9.18 | v62.26,82.88 62.51,83.13 63.63,83.13 IC4.13 65.63,83.13 74.38,83.13 76.13,81.38 79.26,81.38 81,83.13 84.13,83.13 IC5.13 86.13,83.13 v96,83.13 | v97.25,73.01 96.38,73.01 IC7.3 | v8.52,80.75 8.27,80.75 8.27,78.63 IC1.29 | v9.77,82 10.9,83.13 25.64,83.13 IC2.13 27.64,83.13 28.27,82.5 36.39,82.5 37.52,81.38 40.64,81.38 42.39,83.13 44.64,83.13 IC3.13 46.64,83.38 v53.89,83.38 | v15.52,27.64 22.39,20.77 24.39,20.77 CF1.21
  Route2 0.203: v8.52,80.75 v9.77,82 | v53.89,83.38 55.64,81.63 60.63,81.63 61.76,82.75 v62.26,82.88
  Bottom 0.203: v65.38,69.38 62.26,72.51 v62.26,82.88 | v97.25,73.01 96,74.26 v96,83.13 | v15.52,27.64 12.15,31.02 12.15,66.01 8.65,69.51 8.65,80.26 v8.52,80.75
EMA0  (via drill 0.61)
  Top 0.203: v82.75,73.38 82,73.38 81.88,73.26 IC6.3
  Route15 0.203: v79.76,50.39 79.26,49.89 79.26,40.27 80.01,39.52 80.01,32.64 73.76,26.39 72.26,26.39 72.26,24.27 71.51,23.52 SBC.35
  Bottom 0.203: v82.75,73.38 80.01,70.63 80.01,50.64 v79.76,50.39
EMA1  (via drill 0.61)
  Top 0.203: v75.26,74.13 80.01,74.13 IC6.2
  Route15 0.203: v75.26,74.13 68.38,67.26 v68.38,62.38
  Bottom 0.203: v68.38,62.38 67.88,61.88 67.88,34.89 67.13,34.14 67.13,19.77 71.01,15.9 SBC.41
EMA2  (via drill 0.61)
  Top 0.203: v77.38,75.13 79.88,75.13 80.01,75.26 IC6.1
  Bottom 0.203: v77.38,75.13 72.26,70.01 72.26,42.01 71.51,41.26 SBC.21
FLASH_L  (via drill 0.61)
  Top 0.203: v25.27,70.26 25.02,70.51 6.77,70.51 6.77,77.13 IC1.26 | v82.75,72.13 83.25,72.63 86.13,72.63 IC6.14
  Route2 0.203: v25.27,70.26 28.27,73.26 81.63,73.26 v82.75,72.13
FLASH_RDY  (via drill 0.61)
  Top 0.203: v93.5,99.38 92.13,100.75 13.27,100.75 11.52,99 10.77,99 10.77,97.88 IC1.15 | v97.25,71.76 97.25,69.38 96.38,69.38 IC7.6
  Bottom 0.203: v93.5,99.38 95.13,97.75 95.13,73.88 v97.25,71.76
FPGA_DONE_H  (via drill 0.61)
  Top 0.203: v108.37,57.89 108.37,55.39 IC12.72 | v98.5,73.01 97.63,73.88 96.38,73.88 IC7.2
  Route2 0.203: v108.37,57.89 108.37,59.26 107.75,59.89 107.75,62.51 107.25,62.51 106.87,62.88 106.62,62.88 100.62,68.88 100.62,73.01 v98.5,73.01
FPGA_INIT_L/RTC_CLK  (via drill 0.61)
  Top 0.203: v93.88,61.88 93.88,62.76 R3.2 | v93.63,71.26 93.75,71.38 94.5,71.38 IC7.4 | v113.5,53.26 109.87,53.26 IC12.68 108.37,53.26 106.25,53.26 104.87,51.89 103.12,51.89 102.37,51.14 99.25,51.14 98.88,51.51 94.75,51.51 v93.88,52.39 | v120.12,20.65 121.62,20.65 122.12,20.15 IC16.7
  Bottom 0.203: v93.63,71.26 93.63,62.13 v93.88,61.88 93.88,61.38 v93.88,52.39 | J3.1 114,56.89 114,53.76 v113.5,53.26 113.62,52.76 114.87,51.51 114.87,47.76 116.75,45.89 116.75,24.02 v120.12,20.65
FPGA_L  (via drill 0.61)
  Top 0.203: v104.62,32.27 104.75,32.27 104.75,35.14 IC12.31 | v89.88,67.26 89.5,67.63 88,67.63 IC6.10
  Route2 0.203: v104.62,32.27 101.5,35.39 89.13,35.39 v88.75,35.77
  Route15 0.203: v88.75,35.77 88.63,35.89 88.63,65.13 89.88,66.38 v89.88,67.26
FPGA_PROGRAM_L  (via drill 0.61)
  Top 0.203: v101.12,63.01 100.12,63.01 R2.2 | v101.25,59.01 101.25,57.89 IC12.85 | v100.87,52.39 103.25,52.39 104.62,53.76 108.37,53.76 IC12.69
  Bottom 0.203: v101.12,63.01 101.25,62.88 v101.25,59.01 101.37,58.51 102.12,57.76 102.12,53.64 v100.87,52.39
FPGA_WR_L/RTC_IO  (via drill 0.61)
  Top 0.203: v104.75,37.52 104.25,37.52 104.25,36.64 IC12.30 | v113.62,37.02 112.75,37.02 R7.2 | v118.12,21.52 121.99,21.52 123.37,20.15 IC16.6
  Route2 0.203: v104.75,37.52 105.25,37.02 v113.62,37.02
  Bottom 0.203: v118.12,21.52 115,24.64 115,34.02 115.75,34.77 115.75,40.52 115.12,41.14 113.87,41.14 113.87,37.39 v113.62,37.02
G0  (via drill 0.61)
  Top 0.203: v115.12,54.64 119.99,59.51 123.74,59.51 126.24,62.01 133.74,62.01 133.99,62.26 138.37,62.26 140.11,64.01 RN2.2 | v82,46.51 82.25,46.76 87.13,46.76 IC12.126
  Route2 0.203: v115.12,54.64 114.62,54.14 111.87,54.14 110.37,52.64 103,52.64 97.5,47.14 82.63,47.14 v82,46.51
GND  (via drill 0.61)
  Top 0.254: 98.56,55.32 99,55.76 99,55.89 99.25,56.14 99.25,56.39 IC12.89 | 98.56,55.32 97.88,54.64 v96.5,54.64 94.75,54.64 94.75,56.39 IC12.98 | IC12.81 103.25,56.39 103.25,55.51 103.5,55.51 104,55.01 104,53.76 102.87,53.76 102.37,53.26 100.62,53.26 98.63,55.26 98.56,55.32 | 91.88,68.13 93.25,68.13 94.5,66.88 IC7.8 96.13,66.26 v96.88,65.51 | 91.88,68.13 89.75,68.13 89.75,73.88 90,74.13 90.38,74.13 90.38,74.26 C9.2 | 84.25,65.63 89.5,65.63 91.88,68.01 91.88,68.13 | 84.25,65.63 82.5,65.63 81.88,66.26 IC6.8 | 97.75,37.52 97.75,41.76 108.37,41.76 IC12.45 | 97.75,37.52 97.75,36.64 IC12.17 | 87.13,54.89 87.13,55.14 IC12.109 88.63,55.39 90.75,55.39 90.75,56.39 IC12.106 | 87.13,54.89 IC12.110 | v82.75,50.26 87.13,50.26 IC12.119 | v84.25,54.89 87,54.89 87.13,54.89 | v95,38.02 93.25,38.02 93.25,36.64 IC12.8 | v101.12,31.77 101.75,31.77 101.75,35.14 IC12.25 | v89.5,38.27 88.63,38.27 IC12.143 | IC12.128 87.13,45.76 v86.25,45.76 85.75,45.64 84.13,45.64 | v89.5,41.39 89.5,41.64 88.88,42.26 88.63,42.26 IC12.135 | 84.13,45.64 74.51,45.64 SBC.18 73.13,45.39 71.88,45.39 SBC.17 70.63,45.39 70.26,45.01 47.51,45.01 47.01,44.51 40.14,44.51 BATB.- | v84.13,45.89 84.13,45.76 84.13,45.64 | v97.63,37.52 97.75,37.52 | v84.25,65.88 84.25,65.76 84.25,65.63 | 24.02,27.02 24.02,26.02 24.27,25.77 24.39,25.77 CF1.17 | 24.02,27.02 24.39,27.02 CF1.16 26.27,27.02 38.39,27.02 | 24.39,28.39 24.39,28.77 CF1.39 24.39,29.02 24.39,29.39 CF1.14 24.39,29.64 24.14,29.64 23.89,29.89 23.89,32.02 24.39,32.02 CF1.12 26.27,32.14 26.52,32.14 26.64,32.27 26.64,33.27 | 24.39,28.39 CF1.15 | 24.02,27.02 24.02,27.14 24.02,28.39 24.27,28.39 24.39,28.39
  Top 0.254: 26.64,33.27 26.27,33.27 CF1.11 | 26.39,34.64 26.27,34.64 CF1.10 | 26.39,34.64 26.64,34.39 26.64,33.39 26.64,33.27 | CF1.8 26.27,37.14 26.52,37.14 26.64,37.02 26.64,34.64 26.52,34.64 26.39,34.64 | 50.89,27.02 50.89,25.89 56.51,25.89 IC14.8 | 50.89,27.02 50.89,35.77 51.39,36.27 59.14,36.27 C17.2 | 38.39,27.02 50.76,27.02 50.89,27.02 | v38.39,47.39 27.39,47.39 26.27,46.26 CF1.1 | CF1.50 26.27,15.02 35.64,15.02 38.14,17.52 BATA.- 40.14,17.52 49.89,7.77 68.26,7.77 70.63,5.4 SBC.49 | v38.39,26.89 38.39,27.02 | 126.18,11.83 125.12,12.9 IC16.4 125.12,15.02 125.12,16.02 134.37,16.02 136.62,13.77 IC17.13 138.49,13.77 138.99,14.27 138.99,17.9 | 126.18,11.83 130.49,7.52 IC17.7 | 126.18,11.83 126.12,11.77 123.37,9.02 114,9.02 IO2.2 | IC13.19 139.49,42.26 141.86,39.89 146.86,39.89 148.61,38.14 LPT.17 148.49,36.77 148.49,35.39 LPT.18 148.49,34.02 148.49,32.64 LPT.19 148.49,31.14 148.49,29.89 LPT.20 148.49,28.39 148.49,27.14 LPT.21 148.49,25.64 148.49,24.27 LPT.22 148.49,22.89 148.49,21.52 LPT.23 148.49,20.15 148.49,18.77 LPT.24 148.11,17.9 139.11,17.9 138.99,17.9 | IC15.7 130.49,18.02 130.12,18.4 130.12,20.02 130.49,20.02 IC15.5 132.37,20.02 136.12,20.02 136.24,20.02 | 138.99,17.9 138.99,18.77 138.49,18.77 IC15.9 136.62,19.27 136.24,19.27 136.24,20.02 | 136.24,20.02 136.24,20.9 136.62,21.27 IC15.11 136.62,21.77 136.24,21.77 136.24,23.39 136.62,23.77 IC15.13 | KBD.SH3 151.86,71.26 150.36,69.76 KBD.3 150.11,68.76 151.99,66.88 KBD.SH2 152.86,64.38 152.86,60.88 KBD.SH1 | REG2.5.2 101.87,84.88 101.87,85.75 REG2.5.1 104,86.13 104.12,86.13 104.12,87.88 C3.2 104.12,89.25 103.12,90.25 103.12,97.5 104.25,97.5 C1.- 106.87,97.5 113.25,97.5 C2.- 115.87,97.5 117.5,95.88 119.12,95.88
  Top 0.254: C10.2 136.24,67.76 136.37,67.88 136.49,67.88 136.62,68.01 136.62,75.13 134.87,75.13 SER3.9 | v136.99,64.76 136.37,64.13 C11.2 | VGA.6 147.24,94.88 147.24,93.88 VGA.7 | VGA.10 146.86,86.13 146.24,86.13 145.61,85.5 VGA.5 144.36,85 135.24,85 SER2.9 | 119.12,95.88 133.24,95.88 133.99,95.13 SER1.9 | 19.4,76.63 17.4,76.63 16.96,77.07 | 19.4,76.63 27.64,76.63 C5.2 28.77,75.38 28.77,74.88 v47.89,74.88 48.39,75.01 48.76,75.38 69.01,75.38 69.51,75.88 C6.2 69.26,77.26 69.26,78.63 | 16.96,77.07 16.9,77.13 IC1.46 16.9,78.63 17.4,79.13 25.52,79.13 25.64,79.26 IC2.16 | IC1.47 17.15,77.13 17.02,77.13 16.96,77.07 | IC8.1 35.02,71.51 31.77,71.51 C13.2 30.39,71.13 11.27,71.13 9.52,72.88 C8.2 8.65,74.26 8.34,74.57 | 8.34,74.57 7.27,75.63 7.27,77.13 IC1.27 | 19.4,76.63 19.4,76.51 19.4,74.13 12.27,74.13 11.77,74.63 8.4,74.63 8.34,74.57 | 20.21,61.07 20.65,61.51 IC10.7 | 20.21,61.07 19.15,60.01 R4.2 | 20.21,61.07 20.27,61.01 34.64,61.01 35.02,60.63 IC8.10 36.89,60.01 37.52,59.39 38.64,59.39 | v51.39,65.26 50.51,66.13 50.39,66.13 50.26,66.26 C14.2 48.89,67.01 v47.89,67.01 | IC9.10 52.51,60.14 52.14,60.14 v51.64,60.63 51.14,60.51 50.01,59.39 38.64,59.39 | v47.51,79.51 46.64,79.51 IC3.16 | IC12.33 105.75,35.14 105.75,34.52 111.25,34.52 R7.1 | IC13.10 127.49,32.52 126.62,33.39 113.37,33.39 112.75,34.02 R7.1 | IC12.52 109.87,45.26 118,45.26 JTAG.1 | v113.75,48.89 112.87,49.76 109.87,49.76 IC12.61 | IC12.73 107.37,57.89 107.37,58.76 112.62,58.76 113.62,59.76 J3.2 116.37,60.01 121.49,60.01 IC11.8 | v113.5,66.63 113.5,67.51 X1.P$2 | v113.62,34.64 112.75,34.64 R7.1 | 107.31,79.57 105.37,81.5 105.37,83.13 105.87,83.13 106.75,84 110.5,84 110.87,84.38 REG3.3.2 110.87,84.88 110.87,85.75 REG3.3.1 113,86.13 113.12,86.13 113.12,87.38 C4.2 114.12,88.75 114.5,89.13 116.37,89.13 116.37,87.13 116.12,86.88 115.62,86.88 115.62,81.63 115.75,81.5 119.12,81.5 119.12,95.75 119.12,95.88
  Top 0.254: 107.31,79.57 107.81,79.07 | 107.81,79.07 108.12,78.76 C7.2 | 69.26,78.63 69.26,79.26 66.13,79.26 | 66.13,79.26 65.63,79.26 IC4.16 | v66.13,70.38 64.63,70.38 64.51,70.26 IC9.19 | v66.13,78.51 66.13,79.13 66.13,79.26 | 69.26,78.63 69.38,78.63 83.5,78.63 84.13,79.26 IC5.16 86.13,79.26 86.75,78.63 106.37,78.63 107.25,79.51 107.31,79.57 | v112.12,78.26 111.25,79.13 107.87,79.13 107.81,79.07 | v38.64,59.76 38.64,59.51 38.64,59.39
  Route2 0.254: v95,38.02 94.5,38.14 90,38.14 v89.5,38.27
  Bottom 0.254: C105.2 98.25,62.76 98.88,62.76 C107.2 | v96.88,65.51 96.88,64.01 C105.2 | v96.5,54.64 96.5,60.76 96.38,60.88 96.38,62.51 96.88,63.01 C105.2 | C103.2 83.63,49.89 83.63,48.76 C104.2 84.13,47.39 v84.13,45.89 | v82.75,50.26 83.63,50.26 C103.2 | C103.2 84.13,51.26 84.13,54.76 v84.25,54.89 84.25,55.39 v84.25,65.88 | 98.13,33.27 98.88,33.27 C100.2 100.25,33.14 100.25,32.64 v101.12,31.77 | 98.13,33.27 97.75,33.27 C101.2 96.38,34.02 95.88,34.52 95.88,37.14 v95,38.02 | 87.94,39.83 87.13,40.64 87.13,44.89 v86.25,45.76 | 87.94,39.83 v89.5,38.27 | v89.5,41.39 88,39.89 87.94,39.83 | v97.63,37.52 98.13,37.02 98.13,33.39 98.13,33.27 | BATA.- 38.39,19.52 v38.39,26.89 38.39,42.51 BATB.- 38.39,44.51 v38.39,47.39 38.52,47.89 38.64,48.01 v38.64,59.76 | IO2.2 112.87,9.4 112.12,10.15 112.12,19.52 113,20.4 113,21.02 IO1.2 | LPT.25 148.49,16.02 148.49,17.4 LPT.24 | v136.99,64.76 134.87,66.88 134.87,75.13 SER3.9 134.87,76.38 135.74,77.26 135.74,83.75 134.87,84.63 SER2.9 134.87,85.88 135.74,86.75 135.74,93.25 134.87,94.13 SER1.9 | VGA.7 147.24,92.63 147.24,91.63 VGA.8 147.24,90.25 146.49,89.5 146.49,87.75 147.24,87 VGA.10 147.86,85.75 150.49,83.13 150.49,76.13 152.11,74.51 KBD.SH3 | LPT.17 149.11,38.14 152.11,41.14 152.11,57.51 KBD.SH1 | v51.39,65.26 51.64,65.01 v51.64,60.63 | v47.51,79.51 47.89,79.13 v47.89,74.88 v47.89,67.01 | 113.25,48.89 113.25,49.89 C106.2 113.25,51.26 113.25,52.26 112.62,52.89 112.62,58.01 114,59.39 J3.2 | 113.25,48.89 113.25,47.76 C102.2 113.25,46.39 113.25,46.14 112.62,45.51 112.62,35.64 v113.62,34.64 | v113.75,48.89 113.37,48.89 113.25,48.89 | J3.2 114,60.63 113.25,61.38 113.25,66.38 v113.5,66.63 113.37,67.13 112.12,68.38 v112.12,78.26
  Bottom 0.254: JTAG.1 118.5,46.26 118.25,46.51 118.25,51.64 116.87,53.01 116.87,58.51 116,59.39 J3.2 | v66.13,78.51 v66.13,70.38
HS  (via drill 0.61)
  Top 0.203: v85,52.26 86,51.26 87.13,51.26 IC12.117
  Bottom 0.203: v85,52.26 90.63,57.89 90.63,66.88 91.75,68.01 91.75,98.75 93.25,100.25 145.74,100.25 145.74,98.75 148.99,95.5 148.99,91.13 149.74,90.38 VGA.13
INTGNT_L  (via drill 0.61)
  Top 0.203: v79.13,39.27 80.13,38.27 85.63,38.27 86.63,39.27 87.13,39.27 IC12.141 | v79.13,55.89 74.51,55.89 SBC.10
  Bottom 0.203: v79.13,39.27 78.76,39.64 78.76,55.51 v79.13,55.89
INTREQ_L  (via drill 0.61)
  Top 0.203: v95.63,55.51 95.75,55.51 95.75,56.39 IC12.96
  Route2 0.203: v95.63,55.51 95.38,55.76 80.13,55.76 79.13,54.76 72.63,54.76 71.88,55.51 SBC.9
IOCLR_L  (via drill 0.61)
  Top 0.203: v12.4,98.75 12.27,98.75 12.27,97.88 IC1.12 | v29.27,60.14 34.77,54.64 72.13,54.64 73.13,53.64 SBC.12 74.51,53.51 77.88,53.51 81,56.64 84.88,56.64 v87.75,59.51 | v97.88,59.76 100.25,59.76 100.25,57.89 IC12.87
  Route2 0.203: v97.88,59.76 97,60.63 88.88,60.63 v87.75,59.51
  Bottom 0.203: v12.4,98.75 14.02,97.13 14.02,92.5 24.39,82.13 24.39,65.01 v29.27,60.14
KB_CLK  (via drill 0.61)
  Top 0.203: v85.25,40.39 85.63,40.77 87.13,40.77 IC12.138
  Route2 0.203: v85.25,40.39 85.25,40.77 84.88,41.14 84.88,44.39 89.25,44.39 90.5,45.64 96.38,45.64 96.63,45.39 102.25,45.39 104.87,48.01 125.62,48.01 146.74,69.13 KBD.6
KB_DATA  (via drill 0.61)
  Top 0.203: v90.5,42.14 89.38,43.26 88.63,43.26 IC12.133
  Route2 0.203: v90.5,42.14 95.5,42.14 95.88,41.76 103.12,41.76 107.25,45.89 112,45.89 v113.5,44.39
  Route15 0.203: v113.5,44.39 115.25,46.14 115.25,51.89 118,54.64 118,56.26 128.74,67.01 149.11,67.01 KBD.1
LOAD_DAR_H  (via drill 0.61)
  Top 0.203: v49.26,60.26 47.01,60.26 IC8.11 | v49.89,49.89 50.01,49.76 69.38,49.76 70.63,48.51 SBC.15
  Bottom 0.203: v49.26,60.26 49.89,59.64 v49.89,49.89
LXDAR_L  (via drill 0.61)
  Top 0.203: v98.25,32.39 98.25,35.14 IC12.18 | v80.13,48.26 77.76,50.64 74.51,50.64 SBC.14
  Route2 0.203: v98.25,32.39 97.25,33.39 82.38,33.39 v81.38,34.39
  Bottom 0.203: v81.38,34.39 80.5,35.27 80.5,41.51 80.13,41.89 v80.13,48.26
MA0  (via drill 0.61)
  Top 0.203: v14.9,95.5 15.27,95.5 15.27,96.38 IC1.6 | v37.52,90.88 38.52,89.88 IC2.25 | v56.51,90.75 57.39,89.88 IC3.25 | v75.51,90.75 76.38,89.88 IC4.25 | v90.63,90 96.75,90 96.88,89.88 IC5.25
  Route15 0.203: SBC.30 74.01,31.14 75.51,32.64 75.51,50.89 81.5,56.89 81.5,80.5 90.5,89.5 v90.63,90
  Bottom 0.203: v14.9,95.5 19.65,100.25 37.52,100.25 | 37.52,100.25 v37.52,90.88 | 37.52,100.25 37.52,100.5 46.76,100.5 v56.51,90.75 56.64,91.25 56.64,91.75 60.63,91.75 61.26,91.13 61.26,90.75 v75.51,90.75 75.63,91.25 75.63,92.63 88,92.63 v90.63,90
MA1  (via drill 0.61)
  Top 0.203: v38.39,99.63 37.77,100.25 14.77,100.25 14.77,97.88 IC1.7 | v37.52,87.25 38.39,87.25 IC2.23 40.52,87.25 40.89,87.25 42.64,89 50.76,89 52.51,87.25 57.39,87.25 IC3.23 59.51,87.25 59.89,87.25 61.63,89 66.01,89 67.76,87.25 69.88,87.25 | 69.88,87.25 76.38,87.25 IC4.23 78.51,87.25 78.88,87.25 80.63,89 86.5,89 87.38,88.13 96.13,88.13 96.88,87.38 IC5.23 | v69.88,87 69.88,87.25
  Bottom 0.203: v38.39,99.63 38.39,88.13 v37.52,87.25 | v69.88,87 69.88,61.26 69.51,60.88 69.51,29.39 71.88,29.39 73.13,28.14 SBC.32
MA2  (via drill 0.61)
  Top 0.203: v23.64,94.38 14.02,94.38 14.02,95.75 14.27,96 14.27,96.38 IC1.8 | v41.39,90.88 40.52,90.88 IC2.26 | v54.64,91.5 54.76,91.63 56.89,91.63 57.39,91.13 IC3.26 | v79.38,90.88 78.51,90.88 IC4.26 | v88.13,90.88 96.88,90.88 IC5.26 | v78.63,35.14 76.63,33.14 74.51,33.14 SBC.28
  Route2 0.203: v23.64,94.38 28.02,90 40.52,90 v41.39,90.88 | v54.64,91.5 55.14,91.63 55.26,91.75 78.13,91.75 78.88,91 v79.38,90.88
  Bottom 0.203: v54.64,91.5 53.14,93 41.51,93 41.51,91.38 v41.39,90.88 | v88.13,90.88 v79.38,90.88 79.26,90.38 78.26,89.38 78.26,35.52 v78.63,35.14
MA3  (via drill 0.61)